# EAGLE design NFT-v1.0 (EAGLE 7.7.0)

## Sheet 1 of 5
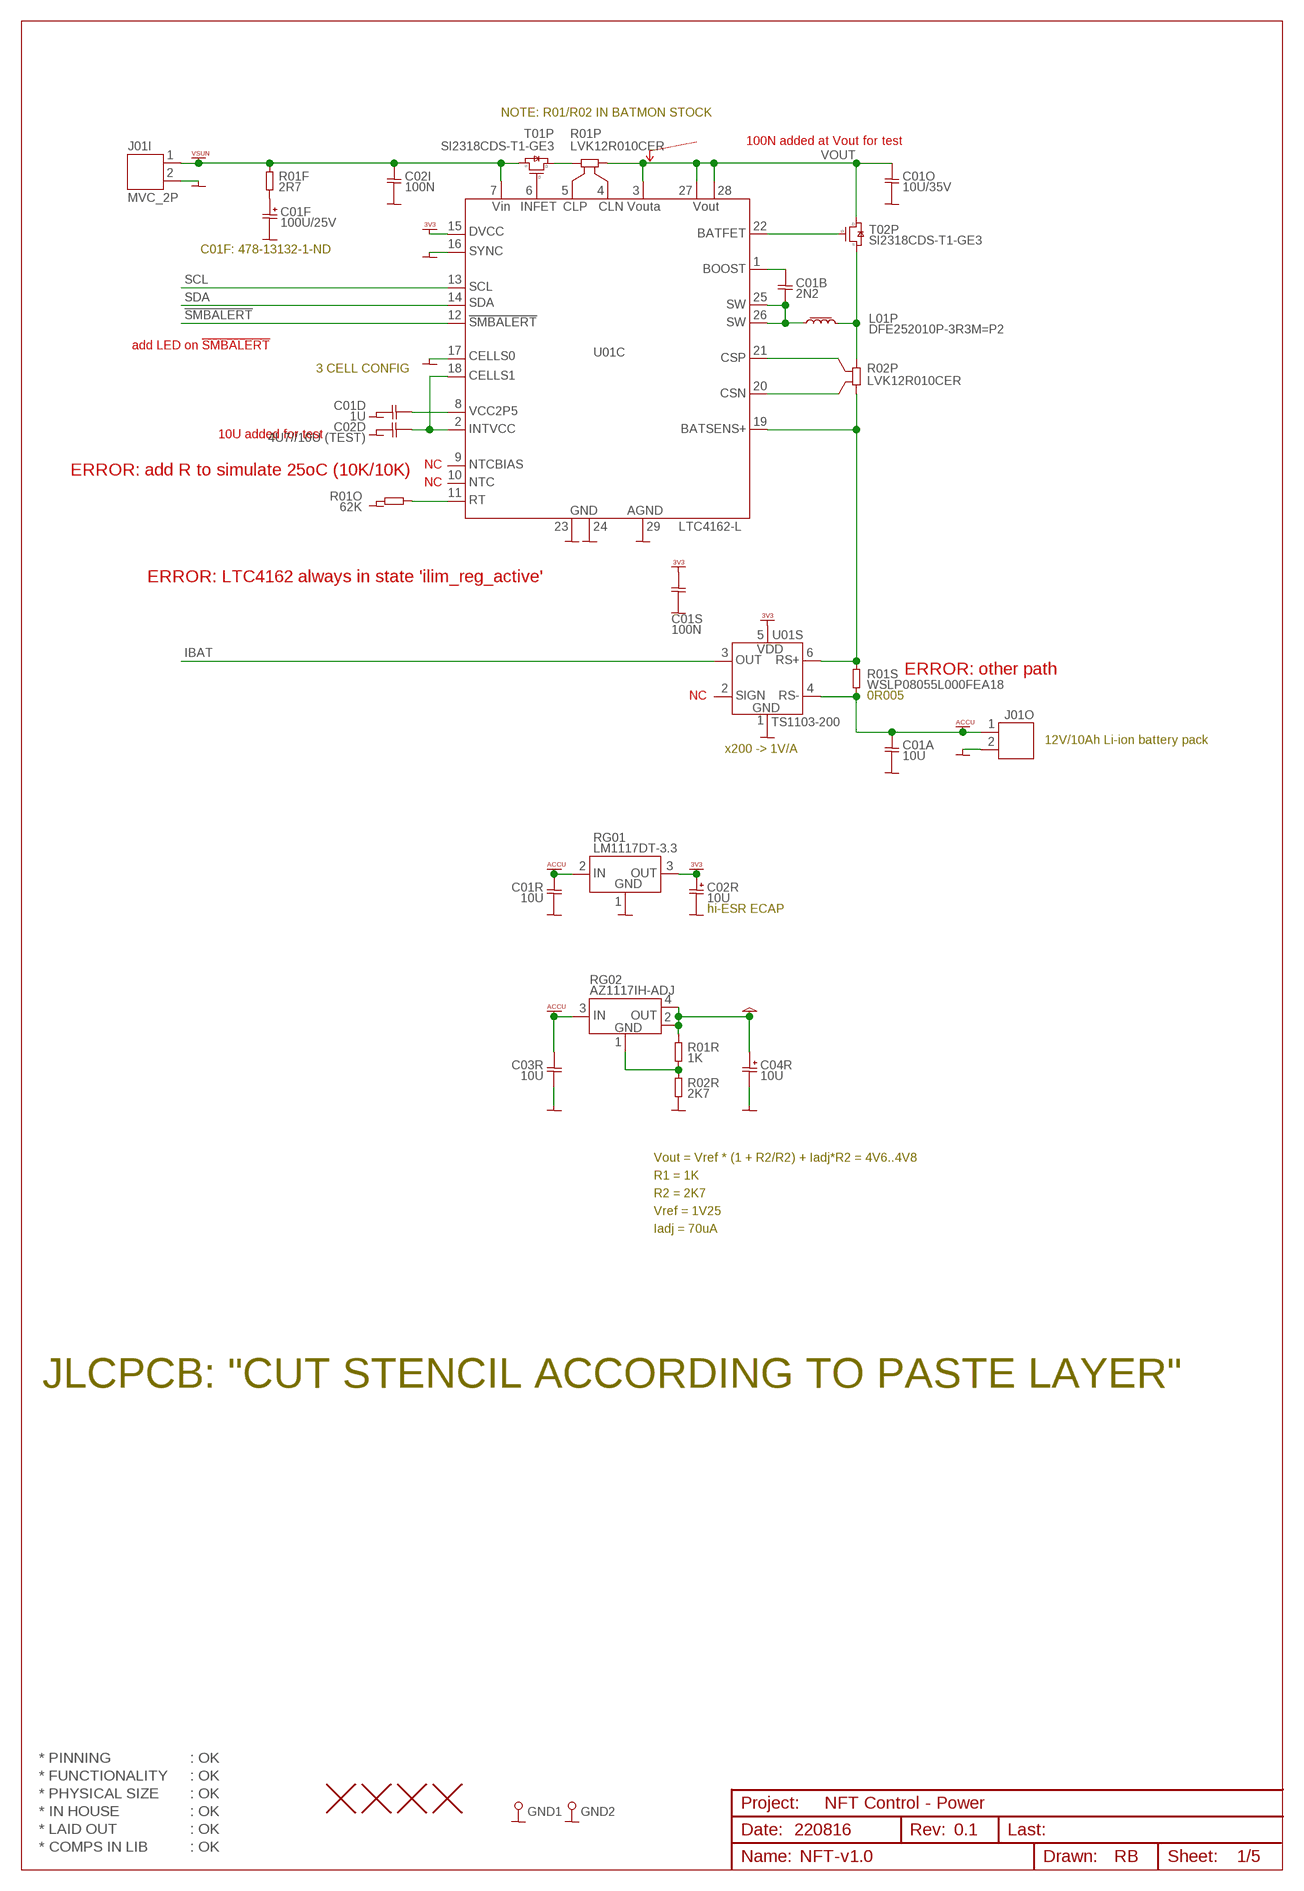
[diagram p0: schematic, sheet 1]

### Parts
C01A  10U  CAP0805  [CAP0805]
C01B  2N2  CAP0402  [CAP0402]
C01D  1U  CAP0402  [CAP0402]
C01F  100U/25V  ECAP_SMD  [ECAP_SMD]
C01O  10U/35V  CAP0805  [CAP0805]
C01R  10U  CAP0603  [CAP0603]
C01S  100N  CAP0402  [CAP0402]
C02D  4U7//10U (TEST)  CAP0402  [CAP0402]
C02I  100N  CAP0402  [CAP0402]
C02R  10U  ECAP_SMA  [ECAP_SMA]
C03R  10U  CAP0603  [CAP0603]
C04R  10U  ECAP_SMA  [ECAP_SMA]
GND1  PIN_TEST  [HOLE_PTH_0.8MM]
GND2  PIN_TEST  [HOLE_PTH_0.8MM]
H1  HOLE_NPTH_3.2MM  [HOLE_NPTH_3.2MM]
H2  HOLE_NPTH_3.2MM  [HOLE_NPTH_3.2MM]
H3  HOLE_NPTH_3.2MM  [HOLE_NPTH_3.2MM]
H4  HOLE_NPTH_3.2MM  [HOLE_NPTH_3.2MM]
J01I  MVC_2P  CON_PHOENIX_COMBICON_MCV_HEADER_2P  [CON_PHOENIX_COMBICON_MCV_HEADER_P]
J01O  CON_PHOENIX_COMBICON_MCV_HEADER_2P  [CON_PHOENIX_COMBICON_MCV_HEADER_P]
L01P  DFE252010P-3R3M=P2  L_1008  [L_1008]
R01F  2R7  RES0603  [RES0603]
R01O  62K  RES0402  [RES0402]
R01P  LVK12R010CER  RES1206_LVK12R010CER1206  [RES1206_LVK12R010CER]
R01R  1K  RES0402  [RES0402]
R01S  WSLP08055L000FEA18  RES0805  [RES0805]
R02P  LVK12R010CER  RES1206_LVK12R010CER1206  [RES1206_LVK12R010CER]
R02R  2K7  RES0402  [RES0402]
RG01  LM1117DT-3.3  [TO252]
RG02  AZ1117IH-ADJ  [SOT223]
T01P  SI2318CDS-T1-GE3  NFET_SOT23  [NFET_SOT23]
T02P  SI2318CDS-T1-GE3  NFET_SOT23  [NFET_SOT23]
U01C  LTC4162-L  [QFN28_4X5]
U01S  TS1103-200  [SOT23-6]

### Nets
!SMBALERT: U01C.12(12.!SMBALERT) ; also sheet 2
ACCU: C01A.1 C01R.1 C03R.1 J01O.1 R01S.2 RG01.2(2.IN) RG02.3(3.IN) U01S.4(4.RS-) ; supply symbol labelled VACCU ; also sheet 5
BATFET: T02P.G(G1) U01C.22(22.BATFET)
BOOST: C01B.1 U01C.1(1.BOOST)
CHARGER_OUT: R01S.1 R02P.1 U01C.19(19.BATSENS+) U01S.6(6.RS+)
CLN: R01P.4 U01C.4(4.CLN)
CLP: R01P.3 U01C.5(5.CLP)
CSN: R02P.3 U01C.20(20.CSN)
CSP: R02P.4 U01C.21(21.CSP)
FB1: R01R.2 R02R.1 RG02.1(1.GND)
GND: C01A.2 C01D.1 C01F.- C01O.2 C01R.2 C01S.2 C02D.1 C02I.2 C02R.- C03R.2 C04R.- GND1.1 GND2.1 J01I.2 J01O.2 R01O.1 R02R.2 RG01.1(1.GND) U01C.16(16.SYNC) U01C.17(17.CELLS0) U01C.23(23.GND) U01C.24(24.GND) U01C.29(29.AGND) U01C.V1(29.AGND) U01C.V2(29.AGND) U01C.V3(29.AGND) U01C.V4(29.AGND) U01S.1(1.GND) ; also sheet 2,3,4,5
IBAT: U01S.3(3.OUT) ; also sheet 2
INFET: T01P.G(G1) U01C.6(6.INFET)
INTVCC: C02D.2 U01C.2(2.INTVCC) U01C.18(18.CELLS1)
N$4: C01F.+ R01F.2
N$10: R01P.1 T01P.D(D3)
N$16: L01P.2 R02P.2 T02P.S(S2)
RT: R01O.2 U01C.11(11.RT)
SCL: U01C.13(13.SCL) ; also sheet 2
SDA: U01C.14(14.SDA) ; also sheet 2
SW: C01B.2 L01P.1 U01C.25(25.SW) U01C.26(26.SW)
VCC: C04R.+ R01R.1 RG02.2(2.OUT) RG02.4(4.OUT) ; also sheet 5
VCC2P5: C01D.2 U01C.8(8.VCC2P5)
VDD_3V3: C01S.1 C02R.+ RG01.3(3.OUT) U01C.15(15.DVCC) U01S.5(5.VDD) ; supply symbol labelled VCC_3V3 ; also sheet 2,3,4
VOUT: C01O.1 R01P.2 T02P.D(D3) U01C.3(3.VOUTA) U01C.27(27.VOUT) U01C.28(28.VOUT)
VSUN: C02I.1 J01I.1 R01F.1 T01P.S(S2) U01C.7(7.VIN)
Unconnected: U01C.9(9.NTCBIAS) U01C.10(10.NTC) U01S.2(2.SIGN)

### Notes on the sheet
- NOTE: R01/R02 IN BATMON STOCK
- 100N added at Vout for test
- C01F: 478-13132-1-ND
- add LED on !SMBALERT
- 3 CELL CONFIG
- 10U added for test
- NC
- ERROR: add R to simulate 25oC (10K/10K)
- NC
- ERROR: LTC4162 always in state 'ilim_reg_active'
- ERROR: other path
- NC | 0R005
- 12V/10Ah Li-ion battery pack
- x200 -> 1V/A
- hi-ESR ECAP
- Vout = Vref * (1 + R2/R2) + Iadj*R2 = 4V6..4V8
- R1 = 1K
- R2 = 2K7
- Vref = 1V25
- Iadj = 70uA
- JLCPCB: "CUT STENCIL ACCORDING TO PASTE LAYER"
- * PINNING | : OK
- * FUNCTIONALITY | : OK
- * PHYSICAL SIZE | : OK
- NFT Control - Power
- * IN HOUSE | : OK
- * LAID OUT | : OK | 220816 | 0.1
- * COMPS IN LIB | : OK

## Sheet 2 of 5
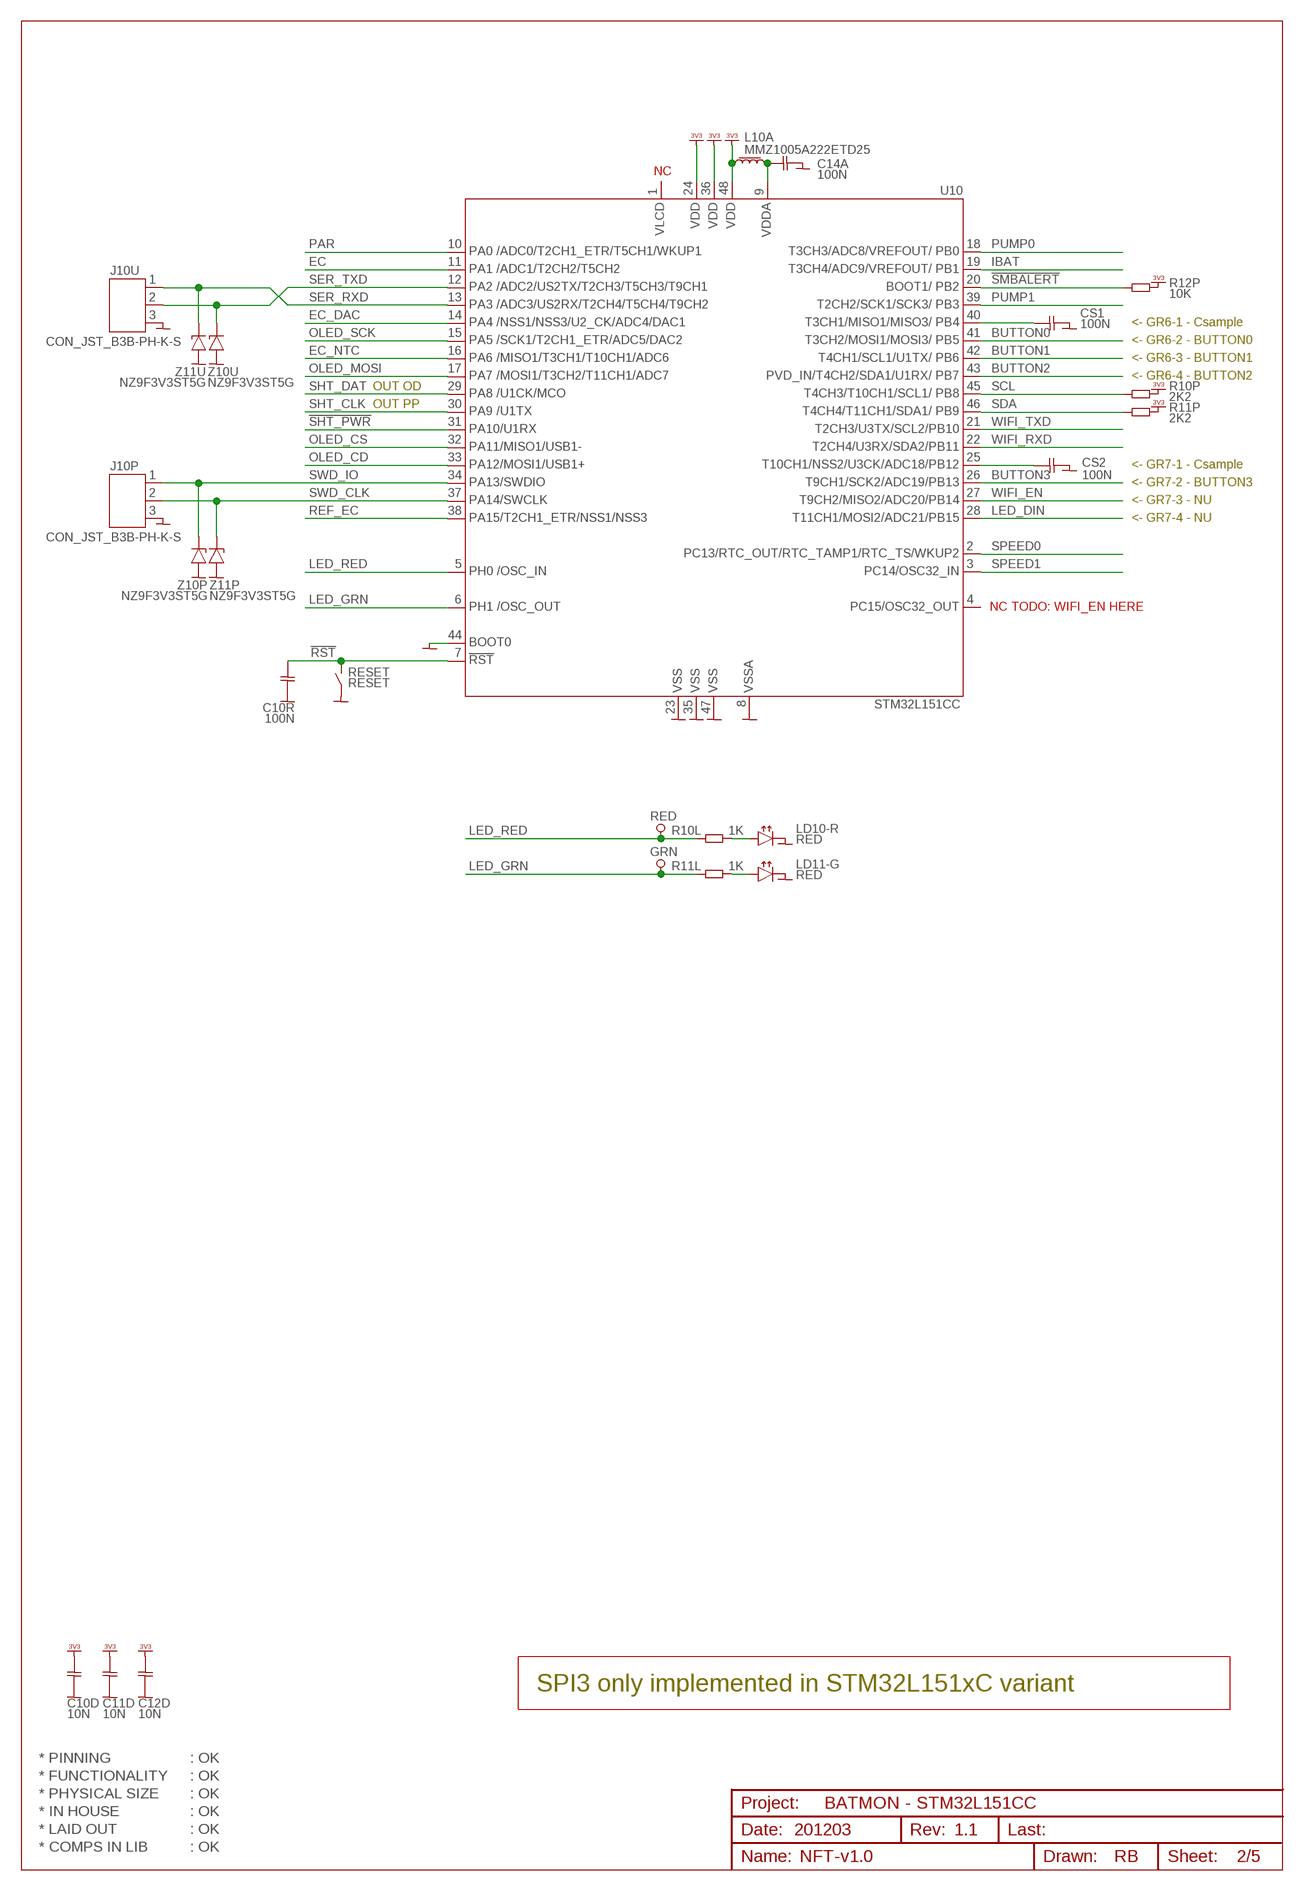
[diagram p1: schematic, sheet 2]

### Parts
C10D  10N  CAP0402  [CAP0402]
C10R  100N  CAP0402  [CAP0402]
C11D  10N  CAP0402  [CAP0402]
C12D  10N  CAP0402  [CAP0402]
C14A  100N  CAP0402  [CAP0402]
CS1  100N  CAP0402  [CAP0402]
CS2  100N  CAP0402  [CAP0402]
GRN  PIN_TEST_0.6MM  [HOLE_PTH_0.6MM]
J10P  CON_JST_B3B-PH-K-S  [CON_JST_B3B-PH-K-S]
J10U  CON_JST_B3B-PH-K-S  [CON_JST_B3B-PH-K-S]
L10A  MMZ1005A222ETD25  L_0402_LOSSY  [L_0402]
LD10-R  RED  LED_SMD_0402  [LED_SMD_0402]
LD11-G  RED  LED_SMD_0402  [LED_SMD_0402]
R10L  1K  RES0402  [RES0402]
R10P  2K2  RES0402  [RES0402]
R11L  1K  RES0402  [RES0402]
R11P  2K2  RES0402  [RES0402]
R12P  10K  RES0402  [RES0402]
RED  PIN_TEST_0.6MM  [HOLE_PTH_0.6MM]
RESET  RESET  SWITCH_PUSHBUTTON  [SWITCH_SMD_PBUTTON_2P]
U10  STM32L151CC  [LQFP48]
Z10P  NZ9F3V3ST5G  ZENER_SOD923  [ZENER_SOD923]
Z10U  NZ9F3V3ST5G  ZENER_SOD923  [ZENER_SOD923]
Z11P  NZ9F3V3ST5G  ZENER_SOD923  [ZENER_SOD923]
Z11U  NZ9F3V3ST5G  ZENER_SOD923  [ZENER_SOD923]

### Nets
!RST: C10R.1 RESET.1(1-2) U10.7(7.!RST)
!SHT_PWR: U10.31(31.PA10) ; also sheet 4
!SMBALERT: R12P.1 U10.20(20.PB2) ; also sheet 1
BUTTON0: U10.41(41.PB5) ; also sheet 3
BUTTON1: U10.42(42.PB6) ; also sheet 3
BUTTON2: U10.43(43.PB7) ; also sheet 3
BUTTON3: U10.26(26.PB13) ; also sheet 3
CSAMPLE: CS1.1 U10.40(40.PB4)
CSAMPLE1: CS2.1 U10.25(25.PB12)
EC: U10.11(11.PA1) ; also sheet 4
EC_DAC: U10.14(14.PA4) ; also sheet 4
EC_NTC: U10.16(16.PA6) ; also sheet 4
GND: C10D.2 C10R.2 C11D.2 C12D.2 C14A.2 CS1.2 CS2.2 J10P.3 J10U.3 LD10-R.C LD11-G.C RESET.2(3-4) U10.8(8.GND) U10.23(23.GND) U10.35(35.GND) U10.44(44.BOOT0) U10.47(47.GND) Z10P.2(A) Z10U.2(A) Z11P.2(A) Z11U.2(A) ; also sheet 1,3,4,5
IBAT: U10.19(19.PB1) ; also sheet 1
LED_DIN: U10.28(28.PB15) ; also sheet 5
LED_GRN: GRN.1 R11L.1 U10.6(6.OSC_OUT)
LED_RED: R10L.1 RED.1 U10.5(5.OSC_IN)
N$23: LD11-G.A R11L.2
N$39: LD10-R.A R10L.2
OLED_CD: U10.33(33.PA12) ; also sheet 3
OLED_CS: U10.32(32.PA11) ; also sheet 3
OLED_MOSI: U10.17(17.PA7) ; also sheet 3
OLED_SCK: U10.15(15.PA5) ; also sheet 3
PAR: U10.10(10.PA0) ; also sheet 4
PUMP0: U10.18(18.PB0) ; also sheet 5
PUMP1: U10.39(39.PB3) ; also sheet 5
REF_EC: U10.38(38.PA15) ; also sheet 4
SCL: R10P.1 U10.45(45.PB8) ; also sheet 1
SDA: R11P.1 U10.46(46.PB9) ; also sheet 1
SER_RXD: J10U.1 U10.13(13.PA3) Z11U.1(C)
SER_TXD: J10U.2 U10.12(12.PA2) Z10U.1(C)
SHT_CLK: U10.30(30.PA9) ; also sheet 4
SHT_DAT: U10.29(29.PA8) ; also sheet 4
SPEED0: U10.2(2.PC13) ; also sheet 5
SPEED1: U10.3(3.PC14) ; also sheet 5
SWD_CLK: J10P.2 U10.37(37.PA14) Z11P.1(C)
SWD_IO: J10P.1 U10.34(34.PA13) Z10P.1(C)
VDD_3V3: C10D.1 C11D.1 C12D.1 L10A.1 R10P.2 R11P.2 R12P.2 U10.24(24.VDD) U10.36(36.VDD) U10.48(48.VDD) ; supply symbol labelled VCC_3V3 ; also sheet 1,3,4
VDDA: C14A.1 L10A.2 U10.9(9.VDD)
WIFI_EN: U10.27(27.PB14) ; also sheet 3
WIFI_RXD: U10.22(22.PB11) ; also sheet 3
WIFI_TXD: U10.21(21.PB10) ; also sheet 3
Unconnected: U10.1(1.VDD) U10.4(4.PC15)

### Notes on the sheet
- NC
- <- GR6-1 - Csample
- <- GR6-2 - BUTTON0
- <- GR6-3 - BUTTON1
- <- GR6-4 - BUTTON2
- OUT OD
- OUT PP
- <- GR7-1 - Csample
- <- GR7-2 - BUTTON3
- <- GR7-3 - NU
- <- GR7-4 - NU
- NC TODO: WIFI_EN HERE
- SPI3 only implemented in STM32L151xC variant
- * PINNING | : OK
- * FUNCTIONALITY | : OK
- * PHYSICAL SIZE | : OK
- BATMON - STM32L151CC
- * IN HOUSE | : OK
- * LAID OUT | : OK | 201203 | 1.1
- * COMPS IN LIB | : OK

## Sheet 3 of 5
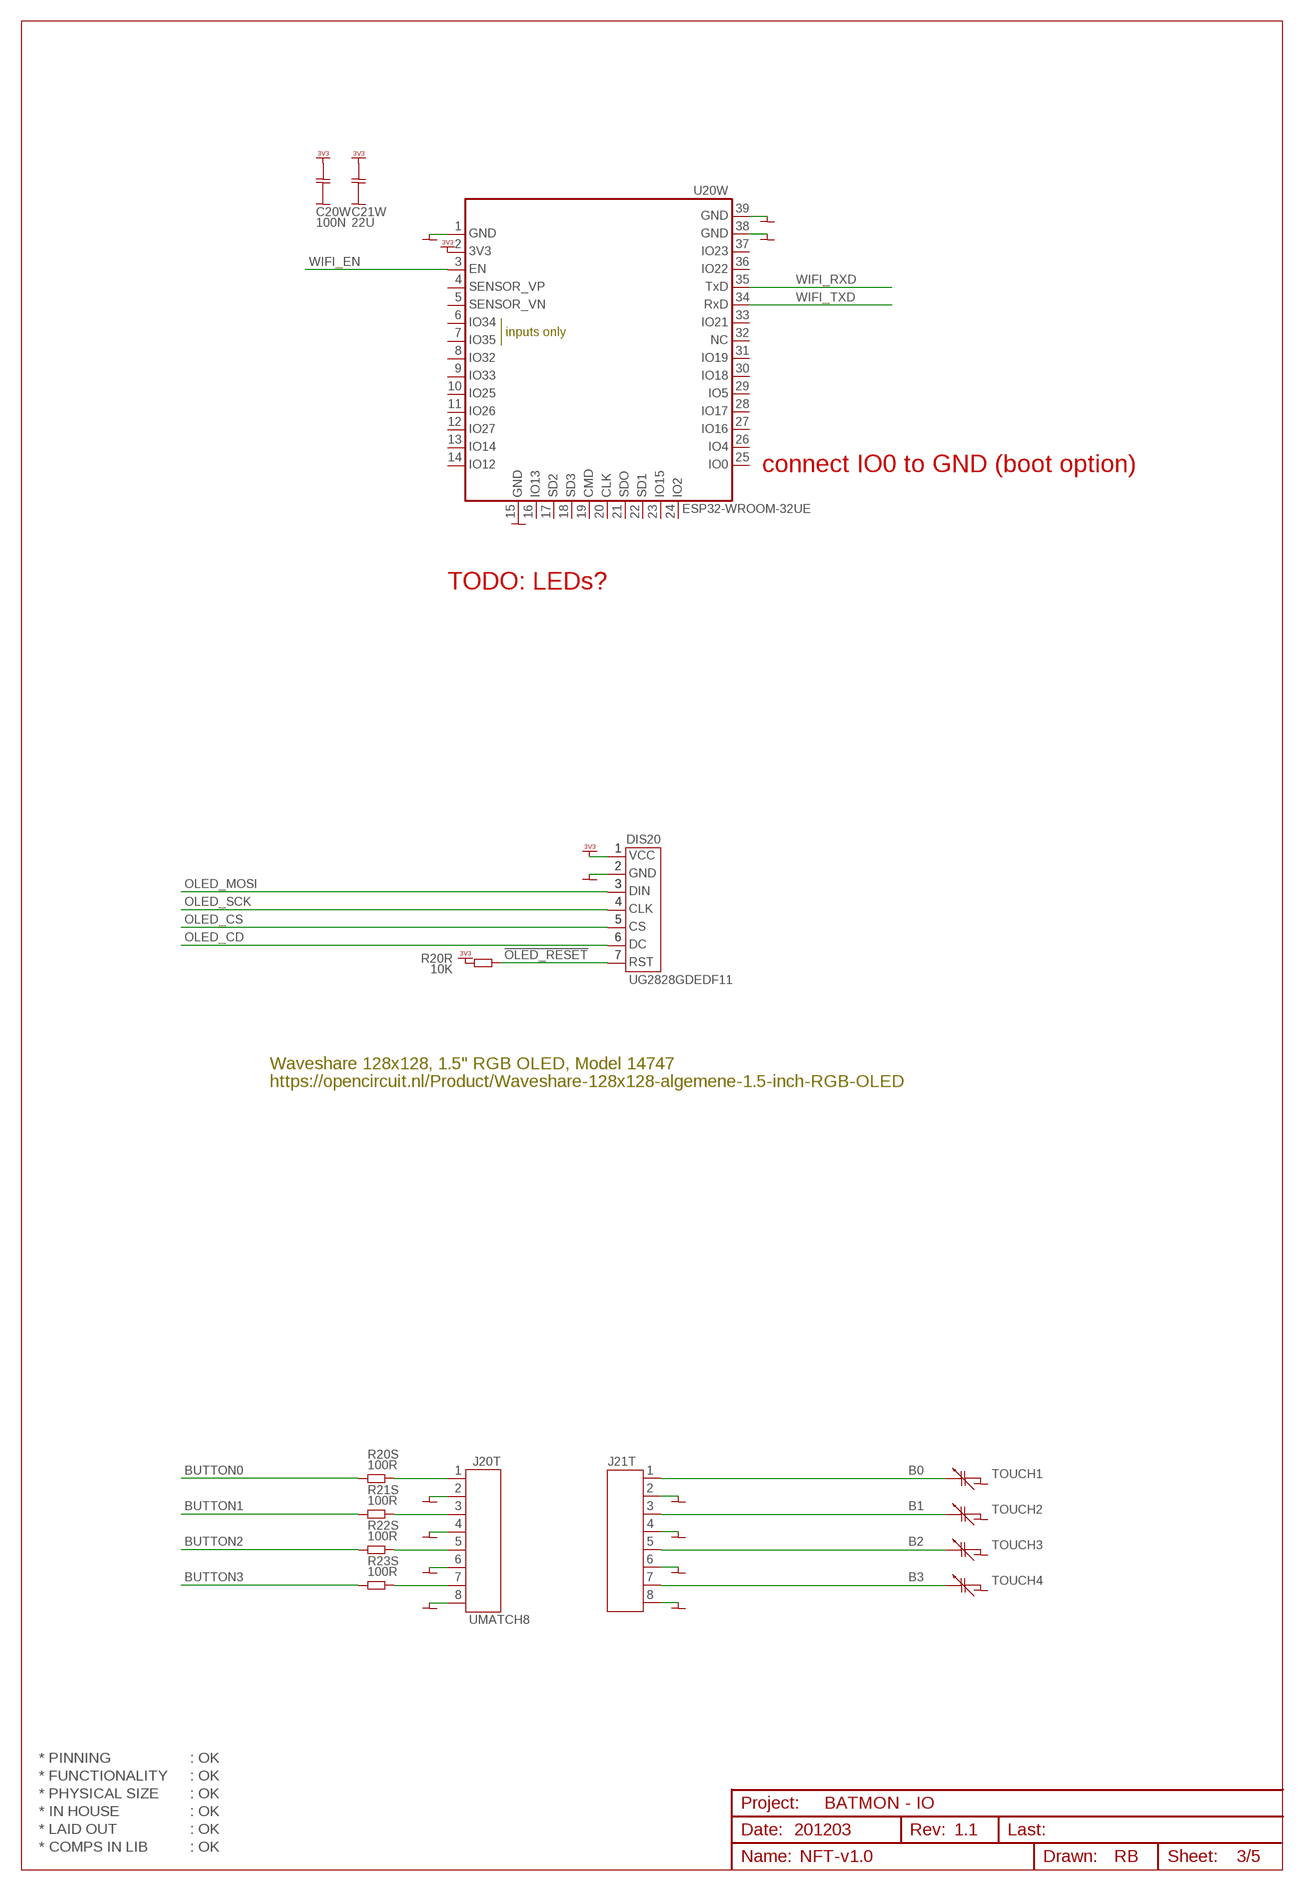
[diagram p2: schematic, sheet 3]

### Parts
C20W  100N  CAP0402  [CAP0402]
C21W  22U  CAP0805  [CAP0805]
DIS20  UG2828GDEDF11  WAVESHARE_1.5"OLED128X128  [WAVESHARE_1.5"OLED128X128]
J20T  UMATCH8  CON_MICROMATCH_8F-TOP  [CON_MICROMATCH_TOP_8F]
J21T  CON_MICROMATCH_8F_SMD-TOP  [CON_MICROMATCH_TOP_8F_SMD]
R20R  10K  RES0402  [RES0402]
R20S  100R  RES0402  [RES0402]
R21S  100R  RES0402  [RES0402]
R22S  100R  RES0402  [RES0402]
R23S  100R  RES0402  [RES0402]
TOUCH1  CAP_TOUCH_ROUND_10MM_SINGLE  [CAP_TOUCH_ROUND_10MM_SINGLE]
TOUCH2  CAP_TOUCH_ROUND_10MM_SINGLE  [CAP_TOUCH_ROUND_10MM_SINGLE]
TOUCH3  CAP_TOUCH_ROUND_10MM_SINGLE  [CAP_TOUCH_ROUND_10MM_SINGLE]
TOUCH4  CAP_TOUCH_ROUND_10MM_SINGLE  [CAP_TOUCH_ROUND_10MM_SINGLE]
U20W  ESP32-WROOM-32UE  [ESP32-WROOM-32UE]

### Nets
!OLED_RESET: DIS20.7(7.RST) R20R.2
B0: J20T.1 J21T.1 R20S.2 TOUCH1.1
B1: J20T.3 J21T.3 R21S.2 TOUCH2.1
B2: J20T.5 J21T.5 R22S.2 TOUCH3.1
B3: J20T.7 J21T.7 R23S.2 TOUCH4.1
BUTTON0: R20S.1 ; also sheet 2
BUTTON1: R21S.1 ; also sheet 2
BUTTON2: R22S.1 ; also sheet 2
BUTTON3: R23S.1 ; also sheet 2
GND: C20W.2 C21W.2 DIS20.2(2.GND) J20T.2 J20T.4 J20T.6 J20T.8 J21T.2 J21T.4 J21T.6 J21T.8 TOUCH1.2 TOUCH2.2 TOUCH3.2 TOUCH4.2 U20W.1(1.GND) U20W.15(15.GND) U20W.38(38.GND) U20W.GND(39.GND) ; also sheet 1,2,4,5
OLED_CD: DIS20.6(6.DC) ; also sheet 2
OLED_CS: DIS20.5(5.CS) ; also sheet 2
OLED_MOSI: DIS20.3(3.DIN) ; also sheet 2
OLED_SCK: DIS20.4(4.CLK) ; also sheet 2
VDD_3V3: C20W.1 C21W.1 DIS20.1(1.VCC) R20R.1 U20W.2(2.3V3) ; supply symbol labelled VCC_3V3 ; also sheet 1,2,4
WIFI_EN: U20W.3(3.EN) ; also sheet 2
WIFI_RXD: U20W.35(35.TXD0) ; also sheet 2
WIFI_TXD: U20W.34(34.RXD0) ; also sheet 2
Unconnected: U20W.4(4.SENSOR_VP) U20W.5(5.SENSOR_VN) U20W.6(6.IO34) U20W.7(7.IO35) U20W.8(8.IO32) U20W.9(9.IO33) U20W.10(10.IO25) U20W.11(11.IO26) U20W.12(12.IO27) U20W.13(13.IO14) U20W.14(14.IO12) U20W.16(16.IO13) U20W.17(17.SD2) U20W.18(18.SD3) U20W.19(19.CMD) U20W.20(20.CLK) U20W.21(21.SDO) U20W.22(22.SD1) U20W.23(23.IO15) U20W.24(24.IO2) U20W.25(25.IO0) U20W.26(26.IO4) U20W.27(27.IO16) U20W.28(28.IO17) U20W.29(29.IO5) U20W.30(30.IO18) U20W.31(31.IO19) U20W.32(32.NC) U20W.33(33.IO21) U20W.36(36.IO22) U20W.37(37.IO23)

### Notes on the sheet
- connect IO0 to GND (boot option)
- TODO: LEDs?
- Waveshare 128x128, 1.5" RGB OLED, Model 14747
- https://opencircuit.nl/Product/Waveshare-128x128-algemene-1.5-inch-RGB-OLED
- * PINNING | : OK
- * FUNCTIONALITY | : OK
- * PHYSICAL SIZE | : OK
- BATMON - IO
- * IN HOUSE | : OK
- * LAID OUT | : OK | 201203 | 1.1
- * COMPS IN LIB | : OK

## Sheet 4 of 5
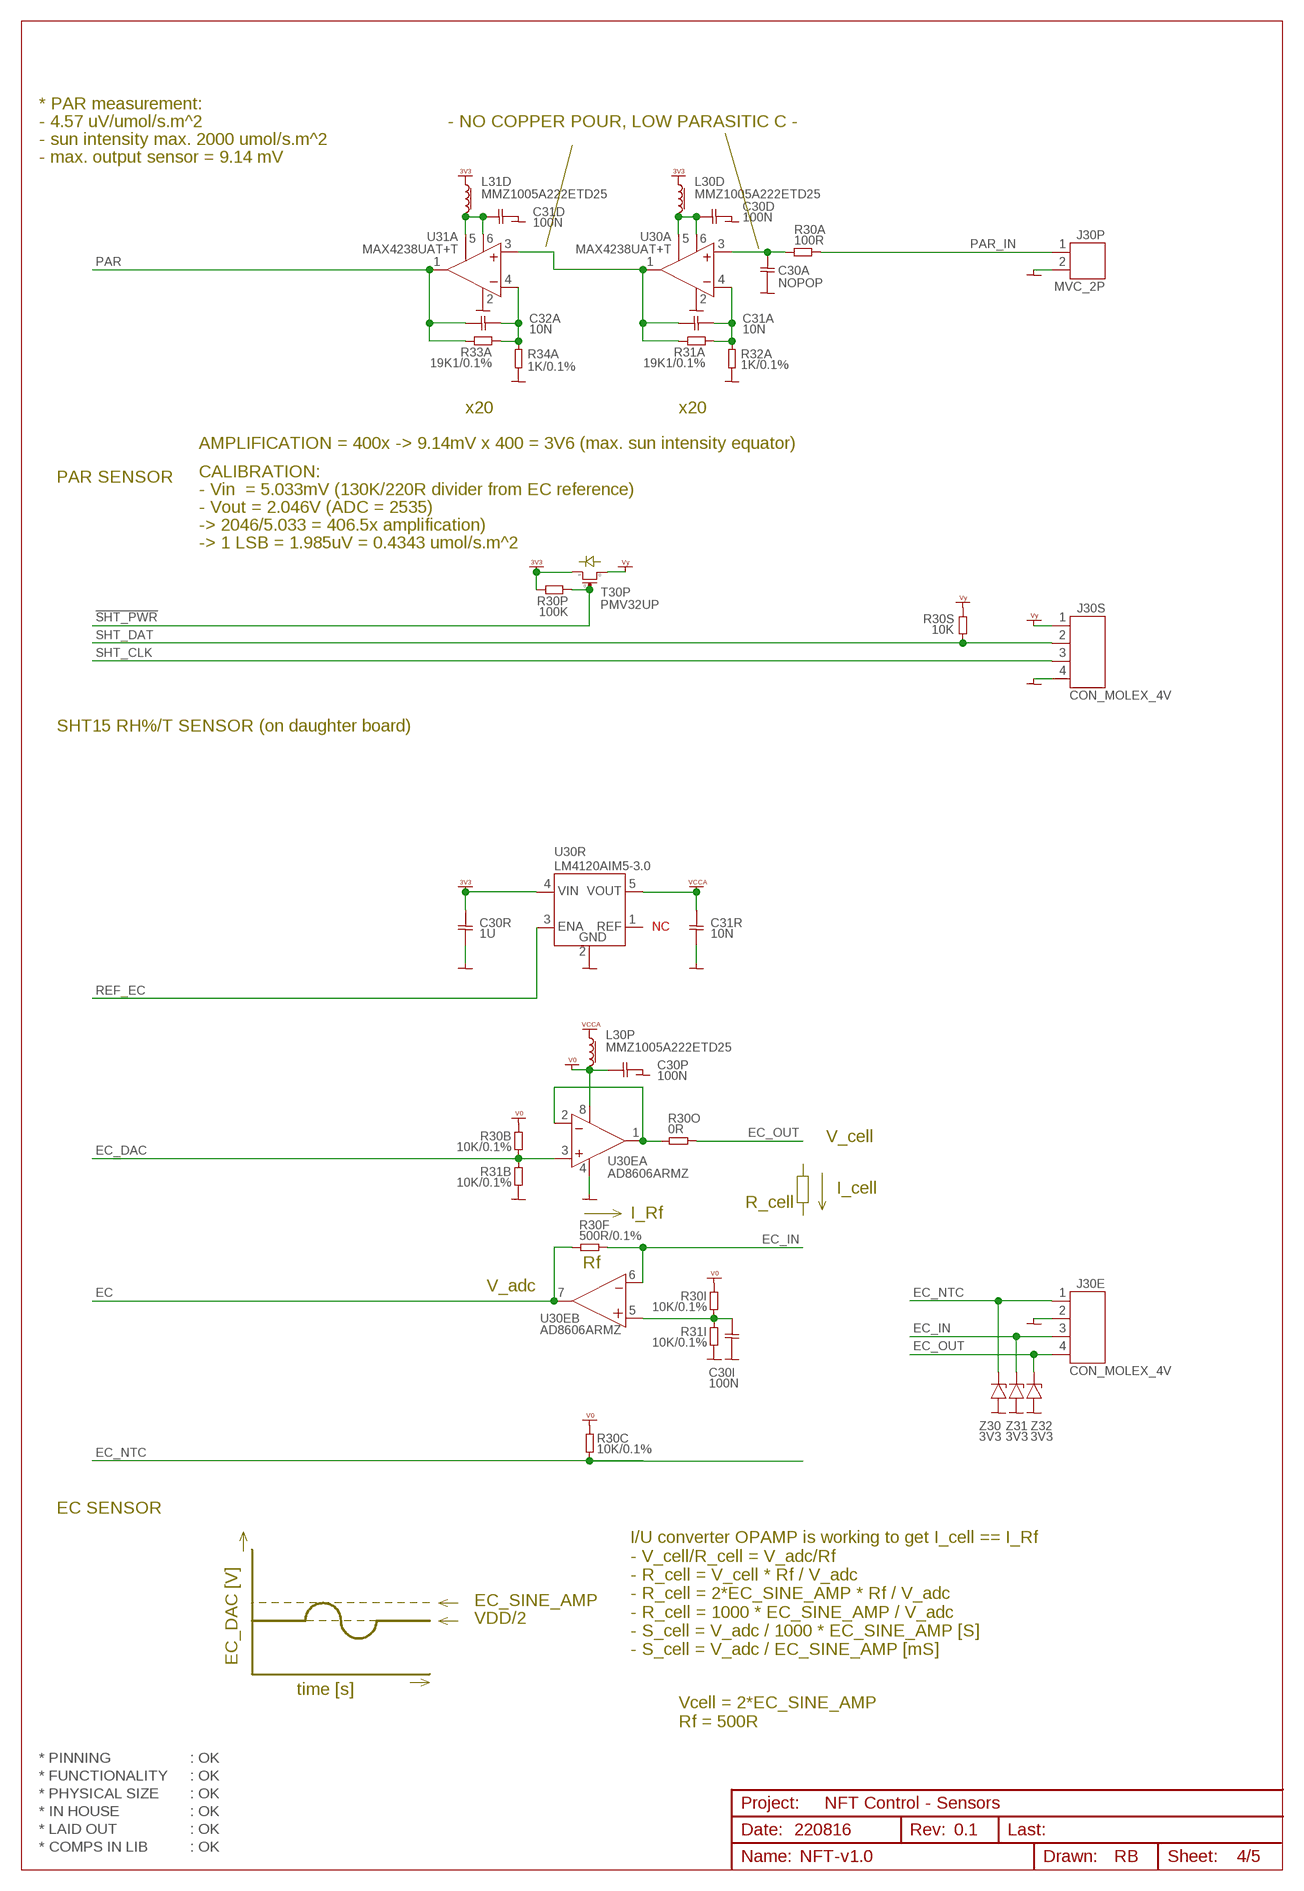
[diagram p3: schematic, sheet 4]

### Parts
C30A  NOPOP  CAP0402  [CAP0402]
C30D  100N  CAP0402  [CAP0402]
C30I  100N  CAP0402  [CAP0402]
C30P  100N  CAP0402  [CAP0402]
C30R  1U  CAP0402  [CAP0402]
C31A  10N  CAP0402  [CAP0402]
C31D  100N  CAP0402  [CAP0402]
C31R  10N  CAP0402  [CAP0402]
C32A  10N  CAP0402  [CAP0402]
J30E  CON_MOLEX_4V  [CON_MOLEX_4V]
J30P  MVC_2P  CON_PHOENIX_COMBICON_MCV_HEADER_2P  [CON_PHOENIX_COMBICON_MCV_HEADER_P]
J30S  CON_MOLEX_4V  [CON_MOLEX_4V]
L30D  MMZ1005A222ETD25  L_0402_LOSSY  [L_0402]
L30P  MMZ1005A222ETD25  L_0402_LOSSY  [L_0402]
L31D  MMZ1005A222ETD25  L_0402_LOSSY  [L_0402]
R30A  100R  RES0402  [RES0402]
R30B  10K/0.1%  RES0402  [RES0402]
R30C  10K/0.1%  RES0402  [RES0402]
R30F  500R/0.1%  RES0402  [RES0402]
R30I  10K/0.1%  RES0402  [RES0402]
R30O  0R  RES0402  [RES0402]
R30P  100K  RES0402  [RES0402]
R30S  10K  RES0402  [RES0402]
R31A  19K1/0.1%  RES0402  [RES0402]
R31B  10K/0.1%  RES0402  [RES0402]
R31I  10K/0.1%  RES0402  [RES0402]
R32A  1K/0.1%  RES0402  [RES0402]
R33A  19K1/0.1%  RES0402  [RES0402]
R34A  1K/0.1%  RES0402  [RES0402]
T30P  PMV32UP  PFET_SOT23  [PFET_SOT23]
U30A  MAX4238UAT+T  [SOT23-6]
U30E  AD8606ARMZ  [MSOP8]
U30R  LM4120AIM5-3.0  [SOT23-5]
U31A  MAX4238UAT+T  [SOT23-6]
Z30  3V3  ZENER_SOD80  [ZENER_SOD80]
Z31  3V3  ZENER_SOD80  [ZENER_SOD80]
Z32  3V3  ZENER_SOD80  [ZENER_SOD80]

### Nets
!SHT_PWR: R30P.2 T30P.1(G) ; also sheet 2
EC: R30F.2 U30E.7(B:7.OUT) ; also sheet 2
EC30_BUF: R30O.2 U30E.1(A:1.OUT) U30E.2(A:2.IN-)
EC_DAC: R30B.2 R31B.1 U30E.3(A:3.IN+) ; also sheet 2
EC_IN: J30E.3 R30F.1 U30E.6(B:6.IN-) Z31.2(C)
EC_NTC: J30E.1 R30C.2 Z30.2(C) ; also sheet 2
EC_OUT: J30E.4 R30O.1 Z32.2(C)
GND: C30A.1 C30D.2 C30I.1 C30P.2 C30R.2 C31D.2 C31R.2 J30E.2 J30P.2 J30S.4 R31B.2 R31I.2 R32A.2 R34A.2 U30A.2(2.V-) U30E.4(A:4.V-) U30R.2(2.GND) U31A.2(2.V-) Z30.1(A) Z31.1(A) Z32.1(A) ; also sheet 1,2,3,5
IMUXF: C30A.2 R30A.2 U30A.3(3.IN+)
N$6: C31D.1 L31D.2 U31A.5(5.!SHDN) U31A.6(6.V+)
N$8: C30I.2 R30I.2 R31I.1 U30E.5(B:5.IN+)
N$15: C30D.1 L30D.2 U30A.5(5.!SHDN) U30A.6(6.V+)
N$20: C32A.2 R33A.1 R34A.1 U31A.4(4.IN-)
N$21: C31A.1 R31A.2 U30A.1(1.OUT) U31A.3(3.IN+)
N$22: C31A.2 R31A.1 R32A.1 U30A.4(4.IN-)
PAR: C32A.1 R33A.2 U31A.1(1.OUT) ; also sheet 2
PAR_IN: J30P.1 R30A.1
REF_EC: U30R.3(3.ENA) ; also sheet 2
SHT_CLK: J30S.3 ; also sheet 2
SHT_DAT: J30S.2 R30S.2 ; also sheet 2
V0: C30P.1 L30P.2 R30B.1 R30C.1 R30I.1 U30E.8(A:8.V+)
VCCA: C31R.1 L30P.1 U30R.5(5.VOUT)
VDD_3V3: C30R.1 L30D.1 L31D.1 R30P.1 T30P.2(S) U30R.4(4.VIN) ; supply symbol labelled VCC_3V3 ; also sheet 1,2,3
VY: J30S.1 R30S.1 T30P.3(D)
Unconnected: U30R.1(1.REF)

### Notes on the sheet
- * PAR measurement:
- - 4.57 uV/umol/s.m^2 | - NO COPPER POUR, LOW PARASITIC C -
- - sun intensity max. 2000 umol/s.m^2
- - max. output sensor = 9.14 mV
- x20 | x20
- AMPLIFICATION = 400x -> 9.14mV x 400 = 3V6 (max. sun intensity equator)
- CALIBRATION:
- PAR SENSOR
- - Vin  = 5.033mV (130K/220R divider from EC reference)
- - Vout = 2.046V (ADC = 2535)
- -> 2046/5.033 = 406.5x amplification)
- -> 1 LSB = 1.985uV = 0.4343 umol/s.m^2
- SHT15 RH%/T SENSOR (on daughter board)
- NC
- V_cell
- I_cell
- R_cell
- I_Rf
- Rf
- V_adc
- EC SENSOR
- EC_SINE_AMP
- VDD/2
- EC_DAC [V]
- I/U converter OPAMP is working to get I_cell == I_Rf
   - V_cell/R_cell = V_adc/Rf 
   - R_cell = V_cell * Rf / V_adc          
   - R_cell = 2*EC_SINE_AMP * Rf / V_adc    
   - R_cell = 1000 * EC_SINE_AMP / V_adc
   - S_cell = V_adc / 1000 * EC_SINE_AMP [S]
   - S_cell = V_adc / EC_SINE_AMP [mS]
- time [s]
- Vcell = 2*EC_SINE_AMP
  Rf = 500R
- * PINNING | : OK
- * FUNCTIONALITY | : OK
- * PHYSICAL SIZE | : OK
- NFT Control - Sensors
- * IN HOUSE | : OK
- * LAID OUT | : OK | 220816 | 0.1
- * COMPS IN LIB | : OK

## Sheet 5 of 5
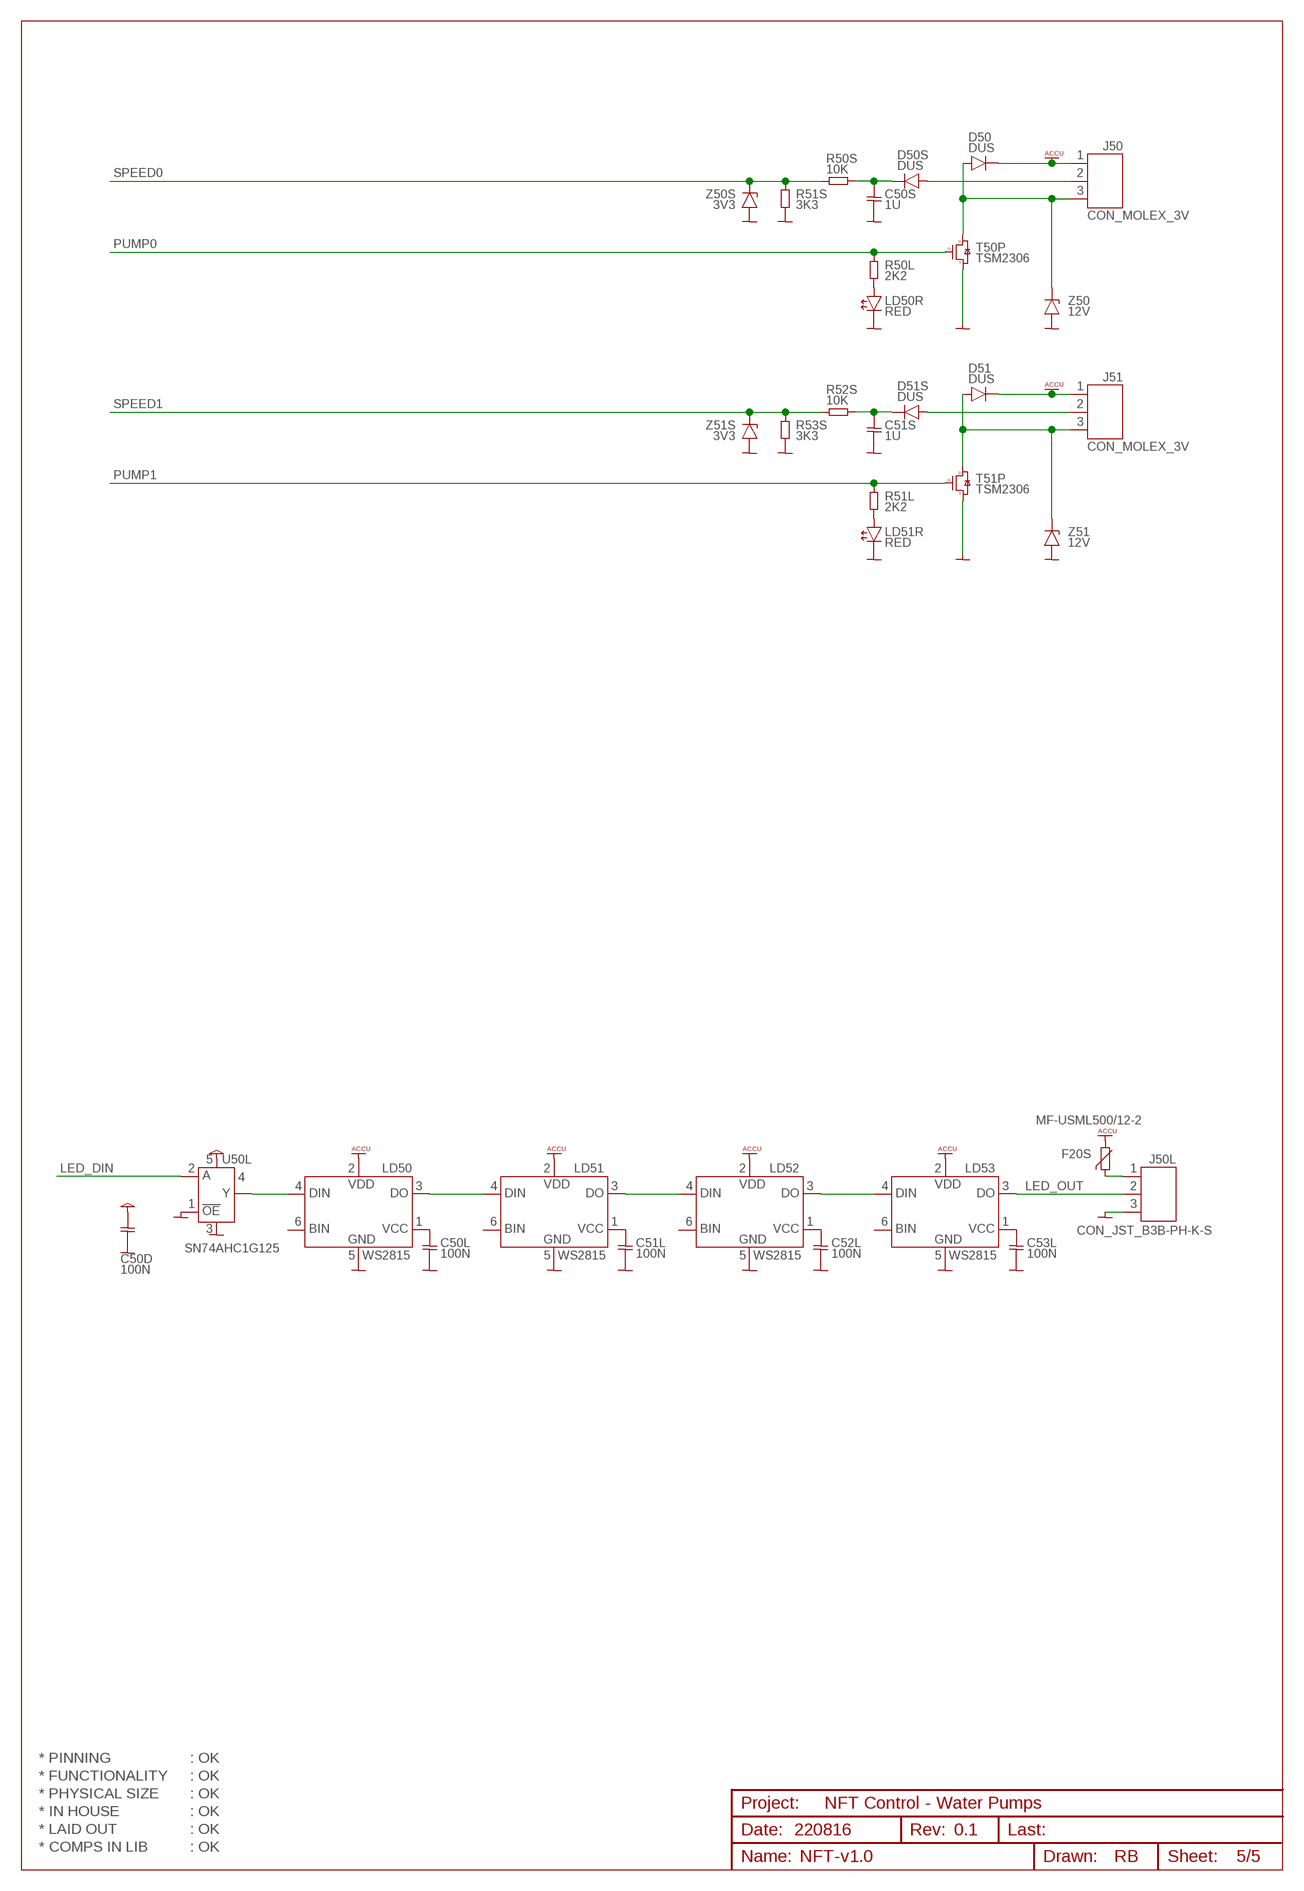
[diagram p4: schematic, sheet 5]

### Parts
C50D  100N  CAP0402  [CAP0402]
C50L  100N  CAP0402  [CAP0402]
C50S  1U  CAP0402  [CAP0402]
C51L  100N  CAP0402  [CAP0402]
C51S  1U  CAP0402  [CAP0402]
C52L  100N  CAP0402  [CAP0402]
C53L  100N  CAP0402  [CAP0402]
D50  DUS  DIODE_1N4148WS  [DIODE_SOD323]
D50S  DUS  DIODE_1N4148WS  [DIODE_SOD323]
D51  DUS  DIODE_1N4148WS  [DIODE_SOD323]
D51S  DUS  DIODE_1N4148WS  [DIODE_SOD323]
F20S  MF-USML500/12-2  PTC1210  [RES1210]
J50  CON_MOLEX_3V  [CON_MOLEX_3V]
J50L  CON_JST_B3B-PH-K-S  [CON_JST_B3B-PH-K-S]
J51  CON_MOLEX_3V  [CON_MOLEX_3V]
LD50  WS2815  [WS2815]
LD50R  RED  LED_SMD_0402  [LED_SMD_0402]
LD51  WS2815  [WS2815]
LD51R  RED  LED_SMD_0402  [LED_SMD_0402]
LD52  WS2815  [WS2815]
LD53  WS2815  [WS2815]
R50L  2K2  RES0402  [RES0402]
R50S  10K  RES0402  [RES0402]
R51L  2K2  RES0402  [RES0402]
R51S  3K3  RES0402  [RES0402]
R52S  10K  RES0402  [RES0402]
R53S  3K3  RES0402  [RES0402]
T50P  TSM2306  NFET_SOT23  [NFET_SOT23]
T51P  TSM2306  NFET_SOT23  [NFET_SOT23]
U50L  SN74AHC1G125  SN74AHC1G125DRLR  [SOT553-5]
Z50  12V  ZENER_SOD80  [ZENER_SOD80]
Z50S  3V3  ZENER_SOD80  [ZENER_SOD80]
Z51  12V  ZENER_SOD80  [ZENER_SOD80]
Z51S  3V3  ZENER_SOD80  [ZENER_SOD80]

### Nets
ACCU: D50.1-(-) D51.1-(-) F20S.2 J50.1 J51.1 LD50.2(2.VDD) LD51.2(2.VDD) LD52.2(2.VDD) LD53.2(2.VDD) ; supply symbol labelled VACCU ; also sheet 1
DI: LD50.4(4.DIN) U50L.4(4.Y)
GND: C50D.2 C50L.2 C50S.2 C51L.2 C51S.2 C52L.2 C53L.2 J50L.3 LD50.5(5.GND) LD50R.C LD51.5(5.GND) LD51R.C LD52.5(5.GND) LD53.5(5.GND) R51S.2 R53S.2 T50P.S(S2) T51P.S(S2) U50L.1(1.OE) U50L.3(3.GND) Z50.1(A) Z50S.1(A) Z51.1(A) Z51S.1(A) ; also sheet 1,2,3,4
LED_DIN: U50L.2(2.A) ; also sheet 2
LED_OUT: J50L.2 LD53.3(3.DO)
N$7: C50L.1 LD50.1(1.VCC)
N$9: C51L.1 LD51.1(1.VCC)
N$11: C52L.1 LD52.1(1.VCC)
N$12: C53L.1 LD53.1(1.VCC)
N$13: LD51R.A R51L.2
N$14: C50S.1 D50S.1-(-) R50S.2
N$17: C51S.1 D51S.1-(-) R52S.2
N$31: F20S.1 J50L.1
N$70: LD50R.A R50L.2
P0: D50.2(+) J50.3 T50P.D(D3) Z50.2(C)
P1: D51.2(+) J51.3 T51P.D(D3) Z51.2(C)
PUMP0: R50L.1 T50P.G(G1) ; also sheet 2
PUMP1: R51L.1 T51P.G(G1) ; also sheet 2
S0: D50S.2(+) J50.2
S1: D51S.2(+) J51.2
SPEED0: R50S.1 R51S.1 Z50S.2(C) ; also sheet 2
SPEED1: R52S.1 R53S.1 Z51S.2(C) ; also sheet 2
VCC: C50D.1 U50L.5(5.VDD) ; also sheet 1
X0: LD50.3(3.DO) LD51.4(4.DIN)
X1: LD51.3(3.DO) LD52.4(4.DIN)
X2: LD52.3(3.DO) LD53.4(4.DIN)
Unconnected: LD50.6(6.BIN) LD51.6(6.BIN) LD52.6(6.BIN) LD53.6(6.BIN)

### Notes on the sheet
- * PINNING | : OK
- * FUNCTIONALITY | : OK
- * PHYSICAL SIZE | : OK
- NFT Control - Water Pumps
- * IN HOUSE | : OK
- * LAID OUT | : OK | 220816 | 0.1
- * COMPS IN LIB | : OK

## Library data of the parts
C01A C01O C21W = 00-own_parts:CAP0805: Capacitor, ceramic, 0805
C01B C01D C01S C02D C02I C10D C10R C11D C12D C14A C20W C30A C30D C30I C30P C30R C31A C31D C31R C32A C50D C50L C50S C51L C51S C52L C53L CS1 CS2 = 00-own_parts:CAP0402: Capacitor, ceramic, 0402
C01F = 00-own_parts:ECAP_SMD: Capacitor, tantalum, case D (2917)
C01R C03R = 00-own_parts:CAP0603: Capacitor, ceramic, 0603
C02R C04R = 00-own_parts:ECAP_SMA: Capacitor, tantalum, case A (1206)
D50 D50S D51 D51S = 00-own_parts:DIODE_1N4148WS: Diode, 1N4148WS, high speed, 100V/350mA, SOD323
DIS20 = 00-own_parts:WAVESHARE_1.5"OLED128X128: Display, OLED, RGB128x128, Vsupply: 3V3..5V, SPI
F20S = 00-own_parts:PTC: PTC multifuse. MF-RX160/72, I holding: 1.6A, I trip: 3.2A. F#:9350144
GND1 GND2 = 00-own_parts:PIN_TEST: Pin, test pad, hole 0.8mm, pad 1.6mm
GRN RED = 00-own_parts:PIN_TEST_0.6MM: Pin, test pad, hole 0.6mm, pad 1.0mm
H1-H4 = 00-own_parts:HOLE_NPTH_3.2MM: Hole, NPTH, 3.2mm
J01I J01O J30P = 00-own_parts:CON_PHOENIX_COMBICON_MCV_HEADER_2P: Connector, Phoenix, COMBICON MCV, 3.5mm, header, male pins, 2p, 1843619, F#370-4816
J10P J10U J50L = 00-own_parts:CON_JST_B3B-PH-K-S: Connector, JST, 2.0mm pitch, 3p, top entry
J20T = 00-own_parts:CON_MICROMATCH_8F: Connector, PCB, micromatch, female, 8p, F# 148-593
J21T = 00-own_parts:CON_MICROMATCH_8F_SMD: Connector, PCB, micromatch, female, 8p, F# 148-593
J30E J30S = 00-own_parts:CON_MOLEX_4V: Connector, Molex, header, straight, 0.1", 4p, F#973-1164
J50 J51 = 00-own_parts:CON_MOLEX_3V: Connector, Molex, header, straight, 0.1", 3p, F#973-1156
L01P = 00-own_parts:L_1008: Inductor, 1008 (2520 metric), chip ferrite bead/wirewound
L10A L30D L30P L31D = 00-own_parts:L_0402_LOSSY: Inductor, chip ferrite bead, lossy, 0402
LD10-R LD11-G LD50R LD51R = 00-own_parts:LED_SMD_0402: LED, SMD, 0402 (PICOLED)
LD50-LD53 = 00-own_parts:WS2815: LED, serial, 12V, 5050
R01F R01O R01R R01S R02R R10L R10P R11L R11P R12P R20R R20S R21S R22S R23S R30A R30B R30C R30F R30I R30O R30P R30S R31A R31B R31I R32A R33A R34A R50L R50S R51L R51S R52S R53S = 00-own_parts:RES
R01P R02P = 00-own_parts:RES1206_LVK12R010CER: Resistor, four terminal current sense, 0.5W, Imax = 20A, RES1206, DK# 273-LVK12R010CERCT-ND
RESET = 00-own_parts:SWITCH_PUSHBUTTON: Switch, push button, SPNO, MCTAEF, F# 160-5485
RG01 = 00-own_parts:LM1117DT-3.3: Regulator, 800mA, Vdrop: 1V, Vin_max: 20V, Vout: 3V3, TO252, F# 948-6275
RG02 = 00-own_parts:AZ1117IH-ADJ: Regulator,adjust/800mA, Vdrop: 1V2, Vin_max: 18V, Vout: 1V5 ≤ Vin-Vout ≤ 10V, SOT223, F#348-3089
T01P T02P T50P T51P = 00-own_parts:NFET_SOT23: n-FET, generic SOT23
T30P = 00-own_parts:PFET_SOT23: p-FET, generic, SOT23
TOUCH1-TOUCH4 = 00-own_parts:CAP_TOUCH_ROUND_10MM_SINGLE: Capacitor, touch sensor, single layer, round 10MM
U01C = 00-own_parts:LTC4162-L: DC/DC converter, battery charger, solar, MMPT, 35V/3A2, QNF28 (4x5mm)
U01S = 00-own_parts:TS1103-200: Current sense amplifier, bi-directional, 200x gain, SOT23-6, F#243-7987
U10 = 00-own_parts:STM32L151CC: MCU, ultra-low power, ARM Cortex M3, 32-bit, 32 MHz, 256 kB Flash, 32 kB SRAM, 8 kB EEPROM, USB, ADC, DAC, LQFP48
U20W = 00-own_parts:ESP32-WROOM-32UE: Wireless module, WiFi & Bluetooth, external u.fl antenna
U30A U31A = 00-own_parts:MAX4238UAT+T: OPAMP, auto-zero, w. 100nA shutdown, rail-to-rail, Voffset = 0.1uV, Voffset drift: 10nV/°C, Ib = 100 pA, Vdd = 2V7..5V5, Idd = 0.6mA, SOT23-5
U30E = 00-own_parts:AD8606ARMZ: OPAMP, dual, single supply, precision low noise rail to rail op-amp, MSOP8, DK# AD8606ARMZ-R7CT-ND
U30R = 00-own_parts:LM4120AIM5-3.0: Reference, series, with enable, 3V00, SOT23-5
U50L = 00-own_parts:SN74AHC1G125DRLR: Buffer, non-inverting, inverted enable, Hi-Z output, single gate, SOT553-5, F#300-6124
Z10P Z10U Z11P Z11U = 00-own_parts:ZENER_SOD923: Zener, generic SOD923
Z30-Z32 Z50 Z50S Z51 Z51S = 00-own_parts:ZENER_SOD80: Zener, generic SOD80

## Board
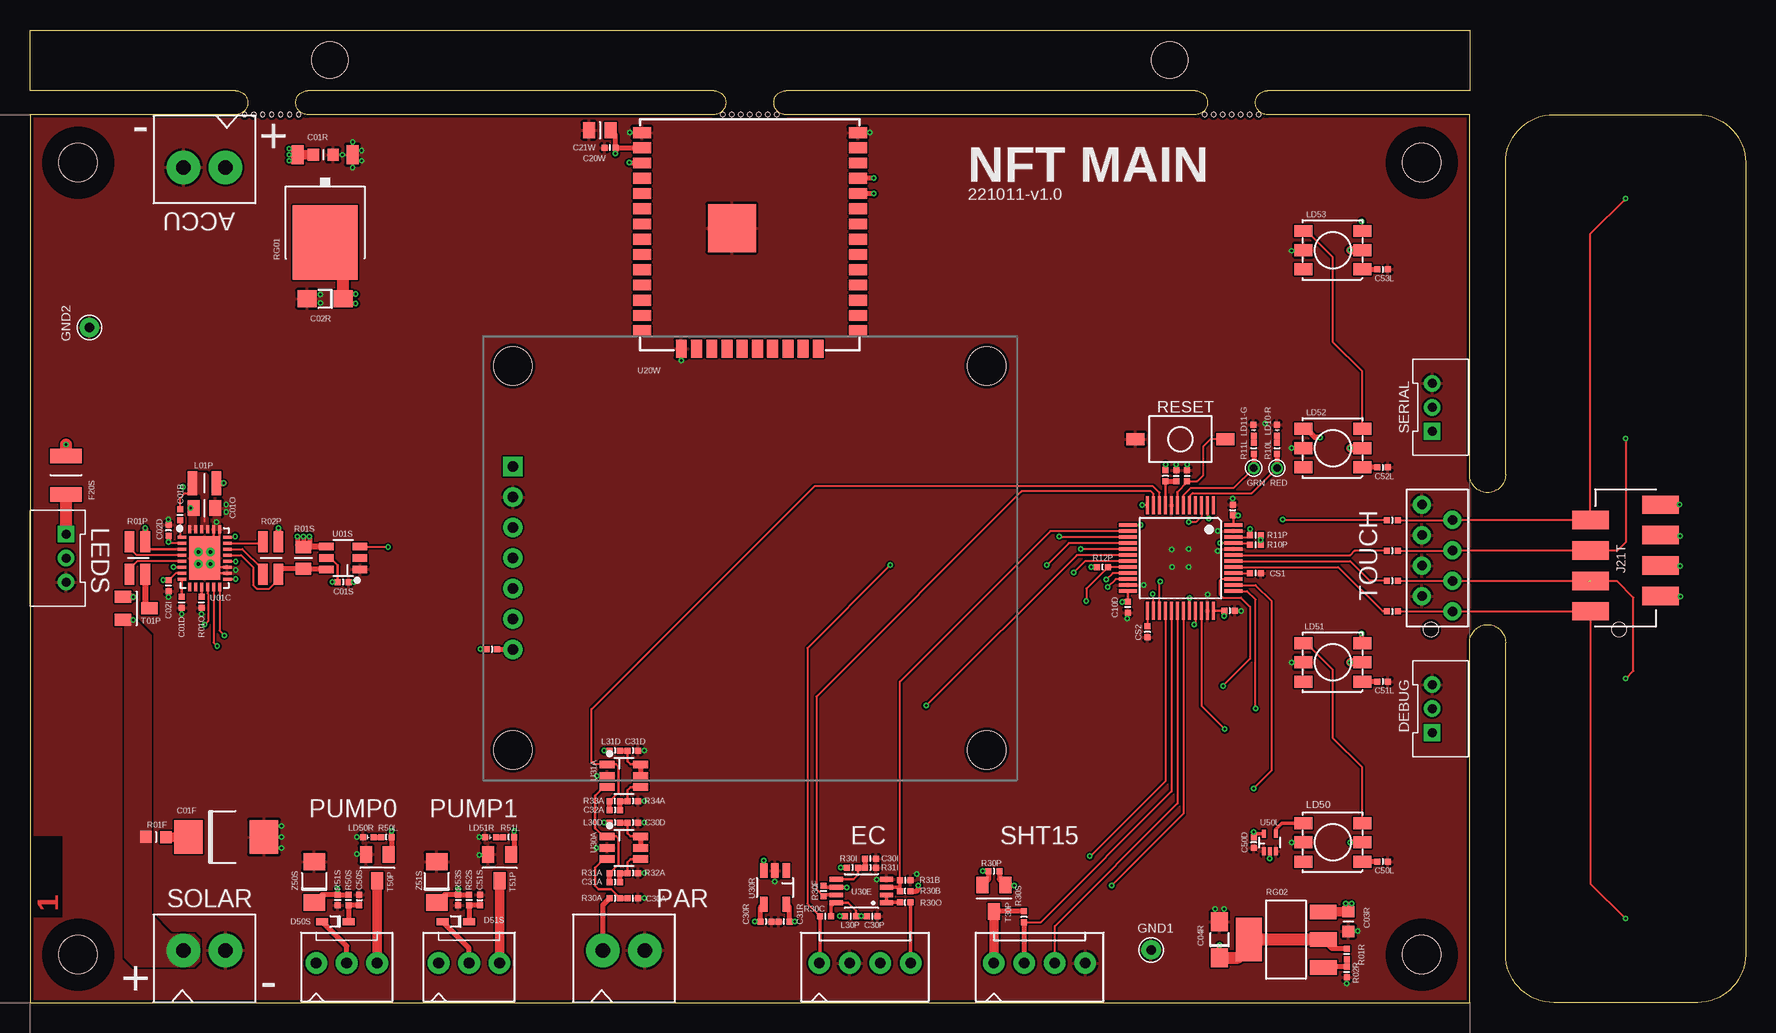
[diagram p5: board, top side]
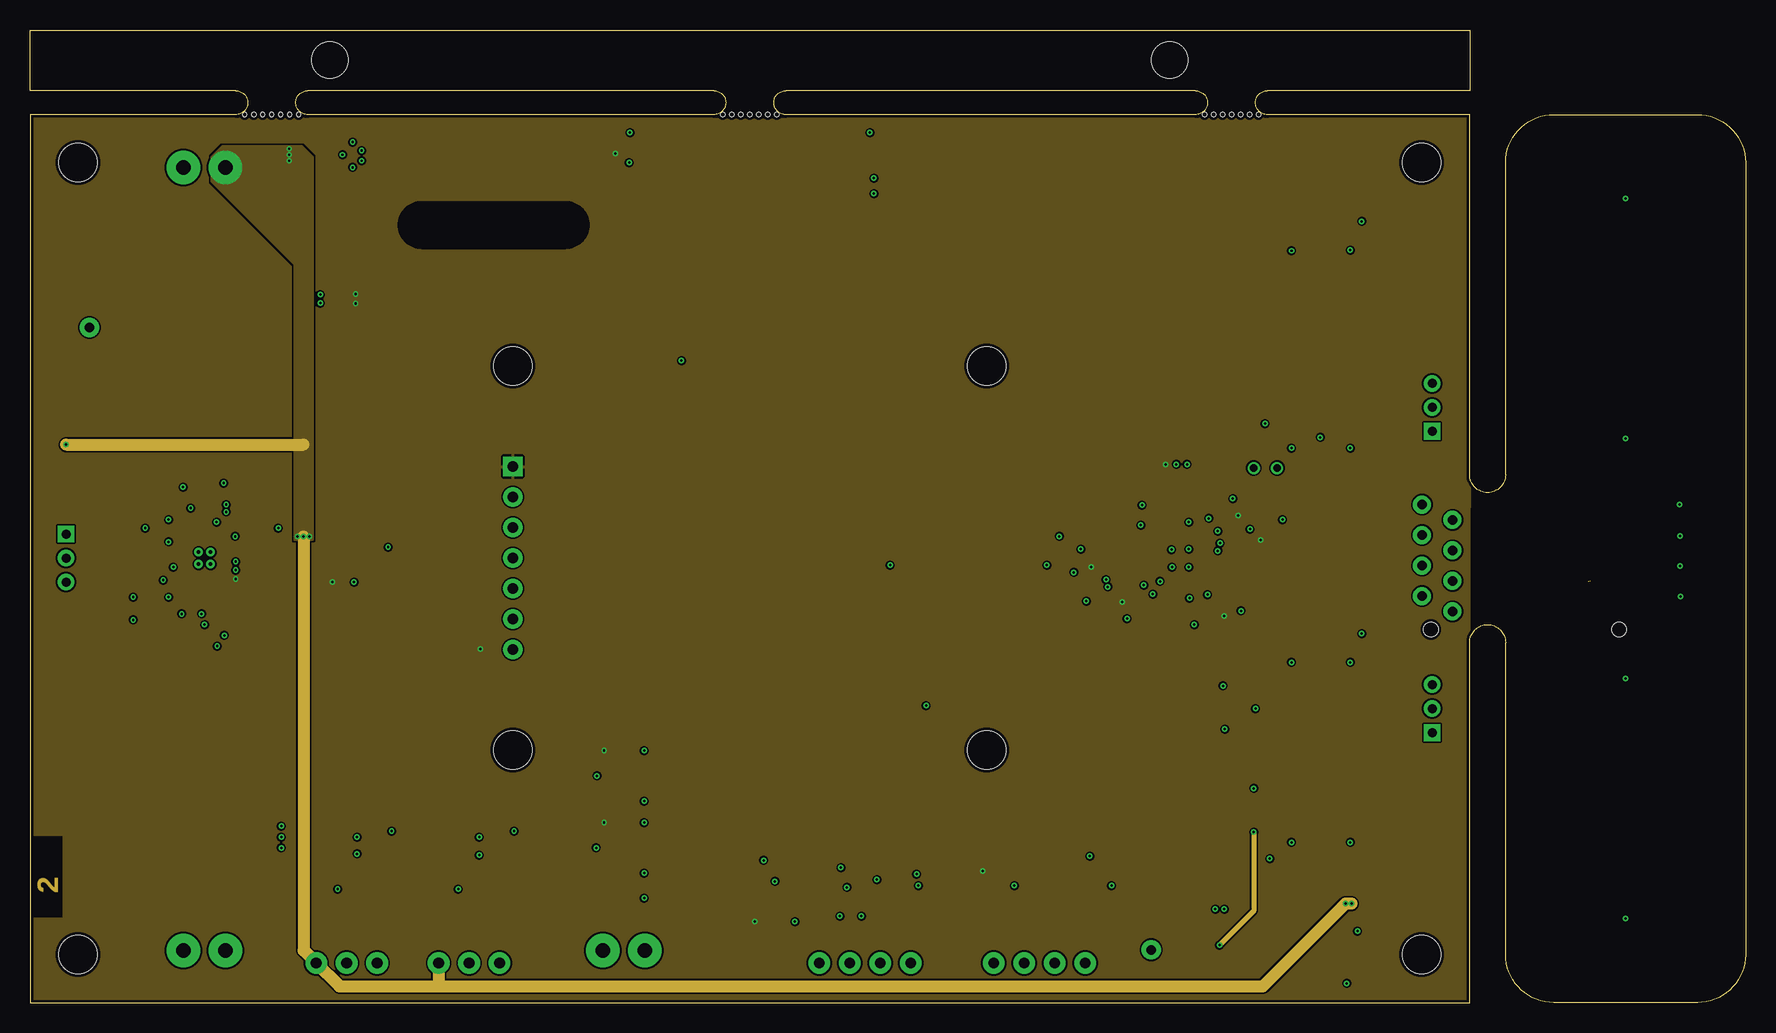
[diagram p6: board, inner layer Route2]
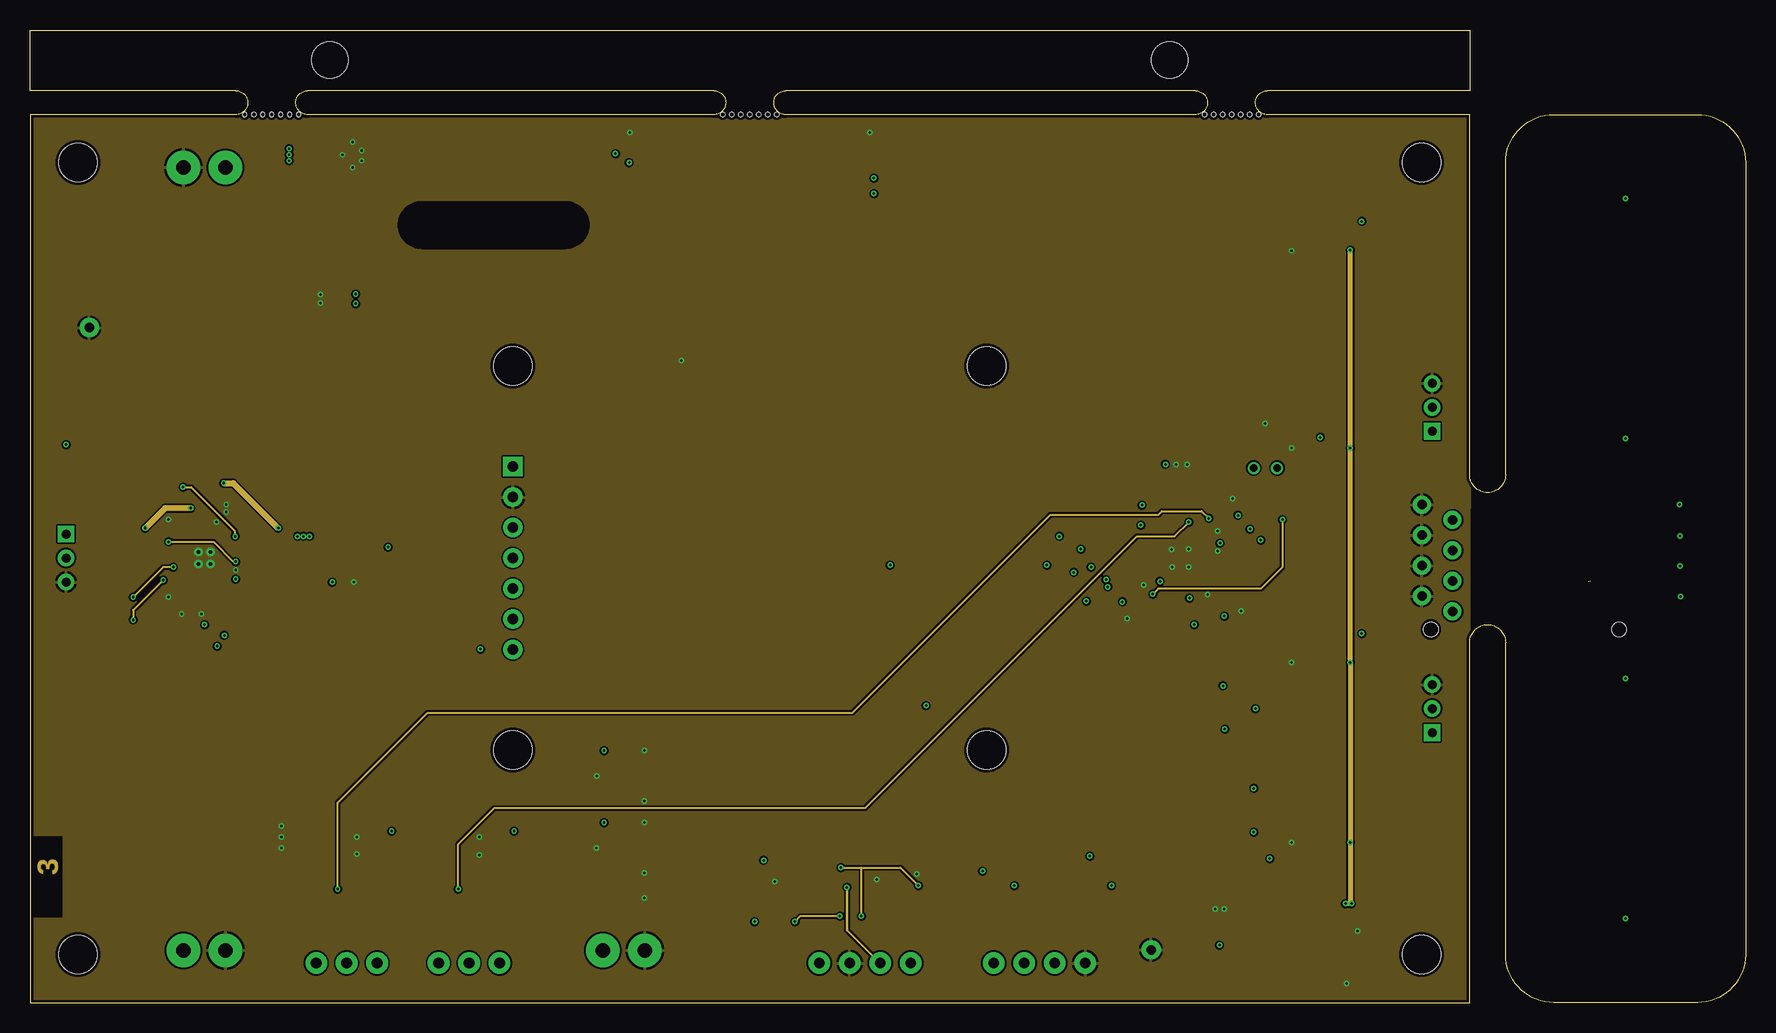
[diagram p7: board, inner layer Route15]
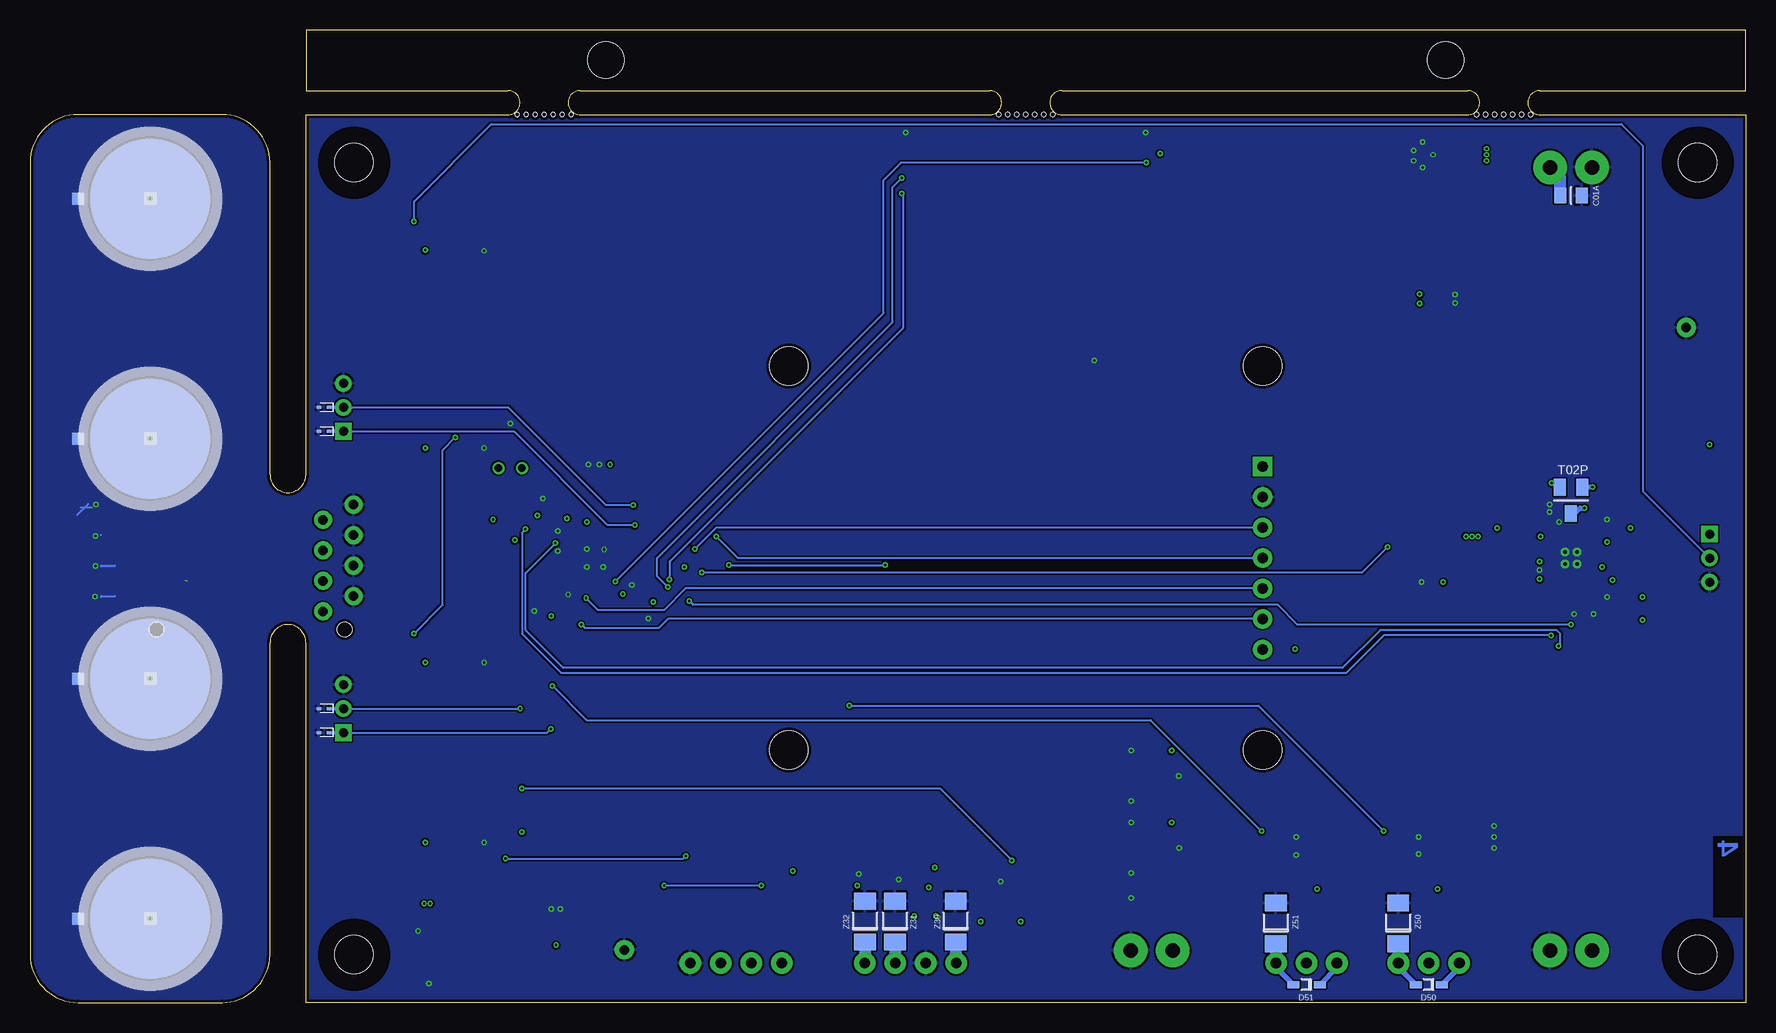
[diagram p8: board, bottom side, seen from below]

Size 143 x 81.05 mm. Coordinates in mm from the lower left corner, seen from the top.
Outline: 103.15,76 120,76 120,81.05 0,81.05 0,76 17.15,76
Outline: 97.15,76 63,76
Outline: 57,76 23.15,76
Outline: 103.15,74 120,74 120,44 arc180 123,44 123,70 arc-90 127,74 139,74 arc-90 143,70 143,4 arc-90 139,0 127,0 arc-90 123,4 123,30 arc180 120,30 120,0 0,0 0,74 17.15,74
Outline: 97.15,74 62.85,74
Outline: 57,74 23.15,74
Copper layers (1*2*15*16): Top 0.018mm / dielectric 0.36mm / Route2 0.035mm / dielectric 0.71mm / Route15 0.035mm / dielectric 0.36mm / Bottom 0.018mm
Design rules "default": minimum track width 0.15mm, minimum drill 0.2mm, track to track 0.15mm, track to pad 0.15mm, pad to pad 0.15mm, via to via 0.15mm, smd to smd 0mil, copper to edge 0.25mm, drill to drill 0.3mm, minimum pad ring 0.2mm, minimum via ring 0.125mm, stop-mask expansion 0.1mm, vias tented up to drill 0.25mm, thermal gap 0.2mm

### Footprints (pad centres in the part's own frame; a part is rotated, then mirrored left to right if it is on the bottom)
CAP0805 = smd 1 x 1.3: 1 -0.9,0; 2 0.9,0
CAP0402 = smd 0.5 x 0.5: 1 -0.45,0; 2 0.45,0
ECAP_SMD = smd 2.4 x 2.8: + -3.15,0; - 3.15,0
CAP0603 = smd 0.95 x 1: 1 -0.821,0.002; 2 0.822,0
ECAP_SMA = smd 1.6 x 1.4: + -1.5,0; - 1.5,0
DIODE_SOD323 = smd 1 x 0.6: 1- -1.1,0; 2 1.1,0
WAVESHARE_1.5"OLED128X128 = drill 0.9 pad 1.6 square: 1 -19.75,7.62 | drill 0.9 pad 1.6: 2 -19.75,5.08; 3 -19.75,2.54; 4 -19.75,0; 5 -19.75,-2.54; 6 -19.75,-5.08; 7 -19.75,-7.62 | hole 3.2: -19.75,-16; -19.75,16; 19.75,16; 19.75,-16
RES1210 = smd 1.2 x 2.6: 1 -1.6,0; 2 1.6,0
HOLE_PTH_0.8MM = drill 0.8 pad 1.6: 1 0,0
HOLE_PTH_0.6MM = drill 0.6 pad 1: 1 0,0
HOLE_NPTH_3.2MM = hole 3.2: 0,0
CON_PHOENIX_COMBICON_MCV_HEADER_P = drill 1.2 pad 2.8: 1 -1.75,0; 2 1.75,0
CON_JST_B3B-PH-K-S = drill 0.75 pad 1.4 square: 1 -2,0 | drill 0.75 pad 1.4: 2 0,0; 3 2,0
CON_MICROMATCH_TOP_8F = drill 0.8 pad 1.5: 1 -4.445,-1.27; 2 -3.175,1.27; 3 -1.905,-1.27; 4 -0.635,1.27; 5 0.635,-1.27; 6 1.905,1.27; 7 3.175,-1.27; 8 4.445,1.27 | hole 1.2: -5.945,0.53
CON_MICROMATCH_TOP_8F_SMD = smd 1.524 x 3.048: 1 -4.445,2.921; 2 -3.175,-2.921; 3 -1.905,2.921; 4 -0.635,-2.921; 5 0.635,2.921; 6 1.905,-2.921; 7 3.175,2.921; 8 4.445,-2.921 | hole 1.2: -5.945,0.53
CON_MOLEX_4V = drill 0.9 pad 1.8: 1 -3.81,0; 2 -1.27,0; 3 1.27,0; 4 3.81,0
CON_MOLEX_3V = drill 0.9 pad 1.8: 1 -2.54,0; 2 0,0; 3 2.54,0
L_1008 = smd 0.8 x 2: 1 -1,0; 2 1,0
L_0402 = smd 0.5 x 0.5: 1 -0.45,0; 2 0.45,0
LED_SMD_0402 = smd 0.5 x 0.5: A -0.45,0; C 0.45,0.001
WS2815 = smd 1.5 x 1: 1 -2.45,1.6; 2 -2.45,0; 3 -2.45,-1.6; 4 2.45,-1.6; 5 2.45,0; 6 2.45,1.6
RES0603 = smd 0.95 x 1: 1 -0.821,0.002; 2 0.822,0
RES0402 = smd 0.5 x 0.5: 1 -0.45,0; 2 0.45,0
RES1206_LVK12R010CER = smd 1.75 x 0.8: 1 -1.372,-0.6; 2 1.372,-0.6; 3 -1.372,0.7; 4 1.372,0.7
RES0805 = smd 1 x 1.3: 1 -0.9,0; 2 0.9,0
SWITCH_SMD_PBUTTON_2P = smd 1.5 x 1: 1 -3.75,0; 2 3.75,0
TO252 = smd 1 x 1.6: 1 -2.28,-4.8; 2 2.28,-4.8 | smd 5.4 x 6.2: 3 0,2.5
SOT223 = smd 1.219 x 2.235: 1 -2.311,-3.1; 2 0,-3.1; 3 2.311,-3.099 | smd 3.607 x 2.184: 4 0,3.099
NFET_SOT23 = smd 1 x 1.4: D 0,1.1; G -0.95,-1.1; S 0.95,-1.1
PFET_SOT23 = smd 1 x 1.4: 1 -0.95,-1.1; 2 0.95,-1.1; 3 0,1.1
CAP_TOUCH_ROUND_10MM_SINGLE = smd 1 x 1: 1 0,0; 2 0,6
QFN28_4X5 = smd 0.7 x 0.25: 1 -1.9,1.75; 2 -1.9,1.25; 3 -1.9,0.75; 4 -1.9,0.25; 5 -1.9,-0.25; 6 -1.9,-0.75; 7 -1.9,-1.25; 8 -1.9,-1.75; 15 1.9,-1.75; 16 1.9,-1.25; 17 1.9,-0.75; 18 1.9,-0.25; 19 1.9,0.25; 20 1.9,0.75; 21 1.9,1.25; 22 1.9,1.75 | smd 0.25 x 0.7: 9 -1.25,-2.4; 10 -0.75,-2.4; 11 -0.25,-2.4; 12 0.25,-2.4; 13 0.75,-2.4; 14 1.25,-2.4; 23 1.25,2.4; 24 0.75,2.4; 25 0.25,2.4; 26 -0.25,2.4; 27 -0.75,2.4; 28 -1.25,2.4 | smd 2.6 x 3.6: 29 0,-0.005 | drill 0.3 pad 0.6: V1 -0.5,0.5; V2 0.5,0.5; V3 -0.5,-0.5; V4 0.5,-0.5
SOT23-6 = smd 0.62 x 1.22: 1 -0.95,-1.4; 2 0,-1.4; 3 0.95,-1.4; 4 0.95,1.4; 5 0,1.4; 6 -0.95,1.4
LQFP48 = smd 0.28 x 1.5: 1 -2.75,-4.4; 2 -2.25,-4.4; 3 -1.75,-4.4; 4 -1.25,-4.4; 5 -0.75,-4.4; 6 -0.25,-4.4; 7 0.25,-4.4; 8 0.75,-4.4; 9 1.25,-4.4; 10 1.75,-4.4; 11 2.25,-4.4; 12 2.75,-4.4; 25 2.75,4.4; 26 2.25,4.4; 27 1.75,4.4; 28 1.25,4.4; 29 0.75,4.4; 30 0.25,4.4; 31 -0.25,4.4; 32 -0.75,4.4; 33 -1.25,4.4; 34 -1.75,4.4; 35 -2.25,4.4; 36 -2.75,4.4 | smd 1.5 x 0.28: 13 4.4,-2.75; 14 4.4,-2.25; 15 4.4,-1.75; 16 4.4,-1.25; 17 4.4,-0.75; 18 4.4,-0.25; 19 4.4,0.25; 20 4.4,0.75; 21 4.4,1.25; 22 4.4,1.75; 23 4.4,2.25; 24 4.4,2.75; 37 -4.4,2.75; 38 -4.4,2.25; 39 -4.4,1.75; 40 -4.4,1.25; 41 -4.4,0.75; 42 -4.4,0.25; 43 -4.4,-0.25; 44 -4.4,-0.75; 45 -4.4,-1.25; 46 -4.4,-1.75; 47 -4.4,-2.25; 48 -4.4,-2.75
ESP32-WROOM-32UE = smd 1.5 x 0.9: 1 -9,7.7; 2 -9,6.43; 3 -9,5.16; 4 -9,3.89; 5 -9,2.62; 6 -9,1.35; 7 -9,0.08; 8 -9,-1.19; 9 -9,-2.46; 10 -9,-3.73; 11 -9,-5; 12 -9,-6.27; 13 -9,-7.54; 14 -9,-8.81; 25 9,-8.81; 26 9,-7.54; 27 9,-6.27; 28 9,-5; 29 9,-3.73; 30 9,-2.46; 31 9,-1.19; 32 9,0.08; 33 9,1.35; 34 9,2.62; 35 9,3.89; 36 9,5.16; 37 9,6.43; 38 9,7.7 | smd 0.9 x 1.5: 15 -5.715,-10.3; 16 -4.445,-10.3; 17 -3.175,-10.3; 18 -1.905,-10.3; 19 -0.635,-10.3; 20 0.635,-10.3; 21 1.905,-10.3; 22 3.175,-10.3; 23 4.445,-10.3; 24 5.715,-10.3 | smd 4 x 4: GND -1.5,-0.25
MSOP8 = smd 0.4 x 1.1: 1 -0.975,-2.1; 2 -0.325,-2.1; 3 0.325,-2.1; 4 0.975,-2.1; 5 0.975,2.1; 6 0.325,2.1; 7 -0.325,2.1; 8 -0.975,2.1
SOT23-5 = smd 0.62 x 1.22: 1 -0.95,-1.4; 2 0,-1.4; 3 0.95,-1.4; 4 0.95,1.4; 5 -0.95,1.4
SOT553-5 = smd 0.3 x 0.67: 1 -0.5,-0.74; 2 0,-0.74; 3 0.5,-0.74; 4 0.5,0.74; 5 -0.5,0.74
EC_MOUSEBITES = hole 0.35: 0,0; 0,-0.75; 0,-1.5; 0,0.75; 0,1.5; 0,2.25; 0,-2.25
EC_TOOL-REGISTRATION = hole 3: 0,0
ZENER_SOD923 = smd 0.36 x 0.25: 1 -0.42,0; 2 0.42,0
ZENER_SOD80 = smd 1.4 x 1.8: 1 -1.7,0; 2 1.7,0

### Placement (x,y rotation side)
C01A  14.55,67.25 0 bottom
C01B  12.5,40.65 90 top
C01D  12.65,33.35 90 top
C01F  16.35,13.8 0 top
C01O  14.55,41.2 0 top
C01R  24.45,70.65 0 top
C01S  26.1,35.05 0 top
C02D  11.55,39.35 270 top
C02I  11.55,34.75 270 top
C02R  24.6,58.65 180 top
C03R  109.9,6.75 270 top
C04R  99.15,5.25 90 top
C10D  91.5,32.95 270 top
C10R  96.45,43.9 90 top
C11D  100,32.66 0 top
C12D  100.25,41.05 90 top
C14A  95.55,43.9 90 top
C20W  48.35,71.25 180 top
C21W  47.5,72.7 180 top
C30A  50.25,8.7 180 top
C30D  50.25,15 0 top
C30I  70.05,12 180 top
C30P  70.2,7.2 0 top
C30R  61.35,6.75 0 top
C31A  48.75,10.05 0 top
C31D  50.25,21 0 top
C31R  62.85,6.75 180 top
C32A  48.75,16.05 0 top
C50D  102,13.35 270 top
C50L  112.75,11.75 0 top
C50S  27.45,8.55 90 top
C51L  112.75,26.75 0 top
C51S  37.5,8.55 90 top
C52L  112.75,44.6 0 top
C53L  112.75,61.1 0 top
CS1  102.15,35.8 0 top
CS2  93.15,30.9 270 top
D50  26.4,1.5 180 bottom
D50S  25.45,6.75 180 top
D51  36.6,1.5 180 bottom
D51S  35.5,6.75 180 top
DIS20  60,37.05 0 top
F20S  3,43.95 90 top
GND1  93.45,4.4 180 top
GND2  4.95,56.25 270 top
GRN  102,44.55 270 top
H1  4,4 0 top
H2  4,70 0 top
H3  116,4 0 top
H4  116,70 0 top
J01I  14.55,4.35 0 top
J01O  14.55,69.6 180 top
J10P  116.88,24.5 90 top
J10U  116.88,49.6 90 top
J20T  117.3,37.05 90 top
J21T  133,37.05 90 top
J30E  69.6,3.3 0 top
J30P  49.5,4.35 0 top
J30S  84.15,3.3 0 top
J50  26.4,3.3 0 top
J50L  3,37.05 270 top
J51  36.6,3.3 0 top
L01P  14.55,43.3 0 top
L10A  94.65,43.9 270 top
L30D  48.75,15 0 top
L30P  68.4,7.2 0 top
L31D  48.75,21 0 top
LD10-R  103.95,47.7 90 top
LD11-G  102,47.7 90 top
LD50  108.6,13.35 180 top
LD50R  28.2,13.8 180 top
LD51  108.6,28.35 180 top
LD51R  38.4,13.8 180 top
LD52  108.6,46.2 180 top
LD53  108.6,62.7 180 top
R01F  10.5,13.8 0 top
R01O  14.3,33.35 90 top
R01P  9,37.05 90 top
R01R  109.75,4.05 270 top
R01S  22.8,37.05 90 top
R02P  20.1,37.05 90 top
R02R  109.75,2.55 270 top
R10L  103.95,46.2 90 top
R10P  102.15,38.15 0 top
R11L  102,46.2 90 top
R11P  102.15,38.95 0 top
R12P  89.4,36.3 180 top
R20R  38.5,29.45 0 top
R20S  113.55,32.6 0 top
R21S  113.55,35.15 0 top
R22S  113.55,37.65 0 top
R23S  113.55,40.2 0 top
R30A  48.75,8.7 0 top
R30B  72.95,9.3 180 top
R30C  66.3,7.2 180 top
R30F  66.15,9.3 270 top
R30I  68.55,11.25 0 top
R30O  72.95,8.35 180 top
R30P  80.35,10.95 0 top
R30S  82.85,7.15 270 top
R31A  48.75,10.8 180 top
R31B  72.95,10.2 0 top
R31I  70.05,11.25 0 top
R32A  50.25,10.8 0 top
R33A  48.75,16.8 180 top
R34A  50.25,16.8 0 top
R50L  29.7,13.8 180 top
R50S  26.55,8.55 270 top
R51L  39.9,13.8 180 top
R51S  25.65,8.55 270 top
R52S  36.6,8.55 270 top
R53S  35.7,8.55 270 top
RED  103.95,44.55 270 top
RESET  95.9,46.95 180 top
RG01  24.6,65.85 180 top
RG02  104.7,5.25 90 top
T01P  8.85,32.85 270 top
T02P  14.55,41.85 180 bottom
T30P  80.35,8.7 180 top
T50P  28.95,11.25 180 top
T51P  39.15,11.25 180 top
TOUCH1  133,7 90 bottom
TOUCH2  133,27 90 bottom
TOUCH3  133,47 90 bottom
TOUCH4  133,67 90 bottom
U01C  14.55,37.05 0 top
U01S  26.1,37.05 90 top
U10  95.9,37.05 180 top
U20W  60,64.8 0 top
U30A  49.5,12.9 270 top
U30E  69.3,9.3 90 top
U30R  62.1,9.6 180 top
U31A  49.5,18.9 270 top
U50L  103.35,13.35 0 top
U$132  [EC_MOUSEBITES]  100.15,74 90 top
U$133  [EC_MOUSEBITES]  60,74 90 top
U$134  [EC_MOUSEBITES]  20.15,74 90 top
U$136  [EC_TOOL-REGISTRATION]  95,78.55 90 top
U$137  [EC_TOOL-REGISTRATION]  25,78.55 90 top
Z10P  118.5,22.5 180 bottom
Z10U  118.5,49.6 180 bottom
Z11P  118.5,24.5 180 bottom
Z11U  118.5,47.6 180 bottom
Z30  65.85,6.75 270 bottom
Z31  70.9,6.75 270 bottom
Z32  73.4,6.75 270 bottom
Z50  28.95,6.6 270 bottom
Z50S  23.7,10.05 270 top
Z51  39.15,6.6 270 bottom
Z51S  33.9,10.05 270 top

### Tracks (layer width: path | path; a pad name or v marks a point on that pad's centre or on a via)
!OLED_RESET
  Top 0.4: R20R.2 40.25,29.45 DIS20.7
!RST
  Top 0.15: C10R.1 97.3,43.45 97.8,43.95 97.8,46.35 98.4,46.95 RESET.1
  Top 0.2: U10.7 95.65,42.55 96.45,43.35 C10R.1
!SHT_PWR  (via drill 0.2 pad 0.4)
  Top 0.15: U10.31 96.15,15.75 v90.15,9.75 | 81.35,9.75 T30P.1
  Top 0.4: R30P.2 80.8,10.3 T30P.1 | v82.05,9.75 81.35,9.75
  Bottom 0.15: v82.05,9.75 v90.15,9.75
!SMBALERT  (via drill 0.2 pad 0.4)
  Top 0.15: U10.20 R12P.1 88.05,34.5 v88.05,33.45 | U01C.12 14.8,34.1 14.85,34.05 14.85,31.8 v14.55,31.5
  Bottom 0.15: v14.55,31.5 37.35,31.5 39,33.15 87.75,33.15 v88.05,33.45
ACCU  (via drill 0.2 pad 0.4)
  Top 0.4: v22.3,38.85 22.3,38.15 22.35,38.1 | v23.3,38.85 23.3,38.05 23.25,38 | v21.6,70.65 RG01.2 | v21.6,71.15 22.3,71.15 22.35,71.1 22.35,70.65 22.35,70.2 22.3,70.15 v21.6,70.15 | v110.15,8.25 110.15,7.7 110.1,7.65 109.98,7.65 C03R.1 | 109.65,7.57 v109.65,8.25 110.1,8.25 110.1,8.2 | v22.8,38.85 R01S.2 | LD50.2 v110.05,13.35
  Top 0.5: U01S.4 23.25,38
  Top 0.7: v110.05,62.7 LD53.2 | LD51.2 v110.05,28.35 | LD52.2 v110.05,46.2
  Top 0.8: RG01.2 22.35,70.65 C01R.1 | RG02.3 109.65,7.57 C03R.1
  Top 1: F20S.2 v3,46.5
  Route2 1: v3,46.5 22.8,46.5 | v22.8,38.85 22.8,4.36 J50.1 25.81,1.35 34.05,1.35 | 34.05,1.35 102.75,1.35 v109.65,8.25 v110.15,8.25 | J51.1 34.06,1.36 34.05,1.35
  Route15 0.4: v109.65,8.25 v110.15,8.25 110.05,8.35 v110.05,13.35 v110.05,28.35 v110.05,46.2 v110.05,62.7
  Bottom 0.4: J51.1 34.06,2.94 D51.1- | 23.86,2.99 23.86,2.94 D50.1-
  Bottom 1: J50.1 23.86,2.99 | C01A.1 15.45,68.75 J01O.1
  pour Route2 (no thermals): 22.05,38.55 22.05,61.5 15.15,68.4 15.15,70.5 16.05,71.4 22.65,71.4 23.55,70.5 23.55,38.55
B0  (via drill 0.2 pad 0.4)
  Top 0.15: TOUCH1.1 130.08,9.92 J21T.1 J20T.1 R20S.2
  other vias: 133,7
B1  (via drill 0.2 pad 0.4)  (1 unrouted)
  Top 0.15: J21T.3 132.25,35.15 133.65,33.75 133.65,27.65 TOUCH2.1 | R21S.2 J20T.3 129.86,35.15 129.9,35.1
  other vias: 133,27
B2  (via drill 0.2 pad 0.4)
  Top 0.15: TOUCH3.1 133.05,46.95 133.05,38.4 132.33,37.69 J21T.5 J20T.5 118.53,37.65 R22S.2
  other vias: 133,47
B3  (via drill 0.2 pad 0.4)
  Top 0.15: TOUCH4.1 130.08,64.08 J21T.7 J20T.7 118.55,40.2 R23S.2
  other vias: 133,67
BATFET  (via drill 0.2 pad 0.4)
  Top 0.15: U01C.22 17.05,38.8 v17.1,38.85
  Route15 0.15: v17.1,38.85 17.1,39.3 13.45,42.95 v12.75,42.95
  Bottom 0.4: v12.75,42.95 T02P.G
BOOST
  Top 0.15: C01B.1 12.5,38.9 12.45,38.85 12.6,38.85 U01C.1
BUTTON0
  Top 0.15: U10.41 109.05,36.3 112.75,32.6 R20S.1
BUTTON1
  Top 0.15: U10.42 110.05,36.8 111.7,35.15 R21S.1
BUTTON2
  Top 0.15: U10.43 110.05,37.3 110.4,37.65 R22S.1
BUTTON3  (via drill 0.2 pad 0.4)
  Top 0.15: 104.38,40.23 v104.4,40.25 104.45,40.2 R23S.1 | U10.26 93.65,34 v93.6,34.05
  Route15 0.15: v93.6,34.05 94.05,34.5 102.6,34.5 104.4,36.3 v104.4,40.25
CHARGER_OUT
  Top 0.15: U01C.19 17.6,37.3 18.6,36.3 18.6,34.8 18.9,34.5 19.95,34.5 20.7,35.25 R02P.1
  Top 0.4: R02P.1 20.7,36.15 R01S.1 22.85,36.1 U01S.6
CLN
  Top 0.15: U01C.4 8.9,37.3 8.3,37.9 R01P.4
CLP
  Top 0.15: U01C.5 8.95,36.8 8.3,36.15 R01P.3
CSAMPLE
  Top 0.15: U10.40 CS1.1
CSAMPLE1
  Top 0.15: U10.25 CS2.1
CSN
  Top 0.15: U01C.20 17.7,37.8 19.35,36.15 19.35,35.73 R02P.3
CSP
  Top 0.15: U01C.21 19.28,38.3 R02P.4
DI
  Top 0.3: LD50.4 104.35,14.95 103.85,14.45 U50L.4
EC
  Top 0.15: U10.11 93.65,42.4 93.45,42.6 82.65,42.6 65.55,25.5 65.55,9.45 R30F.2
  Top 0.3: U30E.7 66.28,8.97 R30F.2
EC30_BUF
  Top 0.3: U30E.2 U30E.1 71.42,8.35 R30O.2
EC_DAC
  Top 0.15: U10.14 85.05,39.3 72.5,26.75 R31B.1
  Top 0.3: R31B.1 72.5,9.6 | 72.5,9.6 R30B.2 | U30E.3 72.47,9.62 72.5,9.6
EC_IN  (via drill 0.2 pad 0.4)
  Top 0.3: R30F.1 66.28,9.62 U30E.6 68.08,9.62 v68.1,9.6
  Route15 0.15: 68.1,6.05 68.12,6.05 J30E.3
  Route15 0.2: v68.1,9.6 68.1,6.05
  Bottom 1: Z31.2 70.9,3.33 J30E.3
EC_NTC  (via drill 0.2 pad 0.4)
  Top 0.15: R30C.2 64.8,8.25 64.8,29.55 v71.7,36.45 | U10.16 86.6,38.3 v84.75,36.45
  Top 0.3: R30C.2 65.85,3.36 J30E.1
  Bottom 0.15: v84.75,36.45 v71.7,36.45
  Bottom 1: Z30.2 65.85,3.36 J30E.1
EC_OUT
  Top 0.3: R30O.1 J30E.4
  Bottom 1: Z32.2 J30E.4
FB1
  Top 0.4: R01R.2 R02R.1 107.86,3 RG02.1
GND  (via drill 0.2 pad 0.4)
  Top 0.15: U01C.29 U01C.V4 | U01C.17 15.45,36.3 15.45,35.8 U01C.16 | U01C.24 15.3,38.55 | 15.3,38.55 15.3,38.25 15.75,38.25 | U01C.23 15.8,39.15 15.75,39.1 15.75,38.55 15.7,38.5 15.35,38.5 15.3,38.55
  Top 0.5: J21T.4 135.94,36.4 v137.55,36.4 | J21T.2 135.95,33.85 v137.6,33.85 | J21T.6 135.98,38.9 v137.55,38.9 | J21T.8 v137.5,41.5
  Bottom 0.15: 137.85,41.25 138.75,41.25 | 137.1,38.95 137.09,38.95 | 137.1,36.35 137.03,36.41 J21T.4 | 137.1,33.8 137.03,33.88 J21T.2 | 138.15,41.55 139.05,40.65
  other vias: 16.35,41.5 17.15,36.05 16.35,40.9 100.95,32.65 100.25,42 96.6,36.3 96.6,37.8 91.45,32 95.2,36.3 95.15,37.75 95.55,44.85 96.45,44.85 12.65,32.4 14.3,32.4 11.55,33.8 11.55,40.25 27,35.05 92.85,34.8 98.15,34 99,39.3 99,37.65 102.95,48.25 105.15,46.2 105.15,28.35 105.15,13.35 110.65,5.95 109.75,1.6 105.15,62.65 70,72.5 50,72.5 54.3,53.5 26.9,71.7 26.9,69.6 27.65,70.15 27.65,71 26.05,70.65 24.2,59 24.2,58.3 15.55,40.05 20.95,14.7 20.95,13.8 20.95,12.9 27.25,12.4 37.45,12.3 27.25,13.8 37.45,13.8 47.2,12.9 47.25,18.9 51.2,21 51.2,16.8 51.2,15 51.2,10.8 51.2,8.7 62.1,10.1 70.6,10.25 73.9,10.7 98.8,7.8 99.55,7.8
  pour Top (rank 6): 120,74.05 120,0.05 0.1,0.05 0.1,74.05
  pour Bottom (rank 6): 120,74.05 120,0.05 0.1,0.05 0.1,74.05
  pour Route15 (rank 3): 119.95,74.05 119.95,58.95 120,54.9 119.95,0.05 0.1,0.2 0.1,74.2
  pour Top (no thermals): 15.3,39.5 15.3,41.3 15.8,41.3 15.8,39.5
  pour Bottom: 120,0 120,74 143,74 143,0
IBAT  (via drill 0.2 pad 0.4)
  Top 0.15: U10.19 87.95,36.8 v87,35.85 | U01S.3 29.8,38 v29.85,37.95
  Bottom 0.15: v87,35.85 31.95,35.85 v29.85,37.95
IMUXF
  Top 0.2: U30A.3 47.8,11.95 47.1,11.25 47.1,9.75 47.4,9.45 48.45,9.45 R30A.2
  Top 0.4: R30A.2 C30A.2
INFET  (via drill 0.2 pad 0.4)
  Top 0.2: U01C.6 v11.95,36.3 | v8.6,33.8 7.95,33.8 7.95,33.75
  Top 0.6: v8.6,33.8 T01P.G
  Route15 0.15: v11.95,36.3 11.1,36.3 v8.6,33.8
INTVCC  (via drill 0.2 pad 0.4)
  Top 0.15: U01C.2 11.65,38.3 v11.55,38.4 | U01C.18 17.1,36.8 v17.15,36.75
  Top 0.4: C02D.2 v11.55,38.4
  Route15 0.15: v17.15,36.75 16.95,36.75 15.3,38.4 v11.55,38.4
LED_DIN  (via drill 0.2 pad 0.4)
  Top 0.15: v88.35,12.2 88.4,12.2 94.65,18.45 U10.28
  Top 0.3: U50L.2 v103.35,12
  Bottom 0.15: v103.35,12 88.55,12 v88.35,12.2
LED_GRN
  Top 0.15: U10.6 96.15,42.3 96.75,42.9 100.35,42.9 GRN.1
  Top 0.4: R11L.1 GRN.1
LED_OUT  (via drill 0.2 pad 0.4)
  Top 0.15: LD53.3 111.05,65.05 v111,65.1
  Bottom 0.15: v111,65.1 111,66.75 104.55,73.2 10.35,73.2 8.55,71.4 8.55,42.6 J50L.2
LED_RED
  Top 0.15: U10.5 96.65,42.2 96.9,42.45 101.85,42.45 RED.1
  Top 0.4: R10L.1 RED.1
N$4
  Top 0.8: R01F.2 C01F.+
N$6
  Top 0.2: C31D.1 49.8,20.1 50.05,19.85 U31A.6
  Top 0.4: L31D.2 C31D.1 | U31A.6 U31A.5
N$7
  Top 0.4: C50L.1 LD50.1
N$8
  Top 0.2: U30E.5 68.62,10.28 69,10.65 R30I.2
  Top 0.4: C30I.2 R31I.1 R30I.2
N$9
  Top 0.4: C51L.1 LD51.1
N$10
  Top 0.5: R01P.1 9.6,33.2 T01P.D
N$11
  Top 0.4: C52L.1 LD52.1
N$12
  Top 0.4: LD53.1 C53L.1
N$13
  Top 0.4: LD51R.A R51L.2
N$14
  Top 0.4: C50S.1 R50S.2 D50S.1-
N$15
  Top 0.2: C30D.1 49.8,14.1 50.05,13.85 U30A.6
  Top 0.4: U30A.6 U30A.5 | L30D.2 C30D.1
N$16  (via drill 0.2 pad 0.4)
  Top 0.5: L01P.2 v16.15,43.3 | v20.7,39.55 R02P.2
  Route15 0.5: v16.15,43.3 16.95,43.3 v20.7,39.55
  Bottom 0.4: 15.5,42.65 T02P.S 15.5,43.3 v16.15,43.3
N$17
  Top 0.4: C51S.1 R52S.2 D51S.1-
N$20
  Top 0.2: R34A.1 49.8,17.7 50.05,17.95 U31A.4
  Top 0.4: R34A.1 R33A.1 C32A.2
N$21
  Top 0.2: R31A.2 49.05,11.55 49.05,13.65 48.85,13.85 U30A.1 47.8,13.85 47.1,14.55 47.1,17.25 47.8,17.95 U31A.3
  Top 0.4: C31A.1 R31A.2
N$22
  Top 0.2: R32A.1 49.8,11.7 50.05,11.95 U30A.4
  Top 0.4: R32A.1 R31A.1 C31A.2
N$23
  Top 0.4: R11L.2 LD11-G.A
N$31
  Top 1: J50L.1 F20S.1
N$39
  Top 0.4: LD10-R.A R10L.2
N$44
  cutout Route15: 46.65,64.8 arc90 44.65,66.8 32.65,66.8 arc90 30.65,64.8 arc90 32.65,62.8 44.65,62.8 arc90
  cutout Route2: 46.65,64.8 arc90 44.65,66.8 32.65,66.8 arc90 30.65,64.8 arc90 32.65,62.8 44.65,62.8 arc90
N$46
  cutout Top: 0.15,7.1 0.15,13.85 2.7,13.85 2.7,7.1
  cutout Bottom: 0.15,7.1 0.15,13.85 2.7,13.85 2.7,7.1
  cutout Route15: 0.15,7.1 0.15,13.85 2.7,13.85 2.7,7.1
  cutout Route2: 0.15,7.1 0.15,13.85 2.7,13.85 2.7,7.1
N$70
  Top 0.4: LD50R.A R50L.2
OLED_CD  (via drill 0.2 pad 0.4)
  Top 0.15: U10.33 97.15,31.6 v97.05,31.5
  Bottom 0.15: v97.05,31.5 96.75,31.2 90.6,31.2 89.83,31.97 DIS20.6
OLED_CS  (via drill 0.2 pad 0.4)
  Top 0.15: U10.32 v96.65,33.7
  Bottom 0.15: DIS20.5 88.34,34.51 90.15,32.7 95.65,32.7 v96.65,33.7
OLED_MOSI  (via drill 0.2 pad 0.4)
  Top 0.15: U10.17 v87.6,37.8
  Bottom 0.15: DIS20.3 85.81,39.59 v87.6,37.8
OLED_SCK  (via drill 0.2 pad 0.4)
  Top 0.15: U10.15 85.85,38.8 v85.8,38.85
  Bottom 0.15: DIS20.4 84,37.05 85.65,38.7 v85.8,38.85
P0
  Top 0.8: T50P.D J50.3
  Bottom 0.4: J50.3 28.94,2.94 D50.2
  Bottom 1: Z50.2 J50.3
P1
  Top 0.8: T51P.D J51.3
  Bottom 0.4: J51.3 39.14,2.94 D51.2
  Bottom 1: Z51.2 J51.3
PAR
  Top 0.15: U10.10 94.15,42.5 93.6,43.05 65.4,43.05 46.8,24.45 46.8,20.1 47.05,19.85 U31A.1
  Top 0.2: R33A.2 49.05,17.55 49.05,19.65 48.85,19.85 U31A.1
  Top 0.4: C32A.1 R33A.2
PAR_IN
  Top 0.4: J30P.1 47.75,8.15 R30A.1
PUMP0  (via drill 0.2 pad 0.4)
  Top 0.15: U10.18 87.25,37.3 v74.7,24.75
  Top 0.4: T50P.G 30.15,12.6 R50L.1 v30.15,14.3
  Bottom 0.15: v74.7,24.75 40.6,24.75 v30.15,14.3
PUMP1  (via drill 0.2 pad 0.4)
  Top 0.15: U10.39 99.35,35.3 99.15,35.1 99.15,34.05 99.45,33.75 100.95,33.75 101.7,33 101.7,28.65 v99.45,26.4
  Top 0.4: T51P.G 40.35,12.6 R51L.1 v40.35,14.3
  Bottom 0.15: v99.45,26.4 96.6,23.55 49.6,23.55 v40.35,14.3
REF_EC  (via drill 0.2 pad 0.4)
  Top 0.15: U10.38 102.15,34.8 103.5,33.45 103.5,19.35 v102,17.85
  Top 0.4: v61.15,11.85 U30R.3
  Bottom 0.15: v102,17.85 67.15,17.85 v61.15,11.85
RT
  Top 0.2: U01C.11 R01O.2
S0
  Top 0.4: J50.2 26.4,4.7 D50S.2
S1
  Top 0.4: J51.2 36.6,4.55 D51S.2
SCL  (via drill 0.2 pad 0.4)
  Top 0.15: U01C.13 15.3,30 v15.6,29.7 | R10P.1 101.55,38.3 U10.45 v99.2,38.3
  Bottom 0.15: v15.6,29.7 15.45,29.85 15.45,30.75 15.75,31.05 30.45,31.05 33.6,27.9 98.55,27.9 101.7,31.05 101.7,35.8 v99.2,38.3
SDA  (via drill 0.2 pad 0.4)
  Top 0.15: U01C.14 15.8,31 v16.2,30.6 | U10.46 101.55,38.8 R11P.1
  Top 0.4: v101.7,39.45 R11P.1
  Bottom 0.15: v16.2,30.6 30.15,30.6 33.3,27.45 98.7,27.45 102,30.75 102,39.15 v101.7,39.45
SER_RXD  (via drill 0.2 pad 0.4)
  Top 0.15: U10.13 v92.6,39.8
  Bottom 0.15: J10U.1 102.65,47.6 94.85,39.8 v92.6,39.8
  Bottom 0.3: Z11U.1 J10U.1
SER_TXD  (via drill 0.2 pad 0.4)
  Top 0.15: U10.12 v92.7,41.45
  Bottom 0.15: J10U.2 103.15,49.6 95,41.45 v92.7,41.45
  Bottom 0.3: Z10U.1 J10U.2
SHT_CLK
  Top 0.15: U10.30 95.65,16.6 85.42,6.37 J30S.3
SHT_DAT
  Top 0.15: U10.29 95.15,17.6 84.25,6.7 R30S.2
  Top 0.4: R30S.2 82.85,3.33 J30S.2
SPEED0  (via drill 0.2 pad 0.4)
  Top 0.15: R51S.1 v25.65,9.45 | U10.2 98.15,40.45 v98.25,40.35
  Top 0.4: R50S.1 R51S.1 24.35,9 Z50S.2
  Route15 0.15: v25.65,9.45 25.65,16.65 33.15,24.15 68.55,24.15 85.05,40.65 94.05,40.65 94.35,40.95 97.65,40.95 v98.25,40.35
SPEED1  (via drill 0.2 pad 0.4)
  Top 0.15: U10.3 97.65,40.5 97.2,40.05 v96.6,40.05
  Top 0.4: R53S.1 R52S.1 | R53S.1 34.55,9 Z51S.2 | R53S.1 v35.7,9.45
  Route15 0.15: v96.6,40.05 95.4,38.85 92.25,38.85 69.6,16.2 38.7,16.2 35.7,13.2 v35.7,9.45
SW
  Top 0.15: 14.55,40.1 14.55,40.5 | C01B.2 12.5,42.05 12.9,42.45 13.65,42.45 13.65,43.2 L01P.1
  pour Top (no thermals): 14.3,39.45 14.3,42.25 14.15,42.4 13.55,42.4 13.45,42.5 13.45,44.05 13.55,44.15 14.65,44.15 14.8,44 14.8,39.45
SWD_CLK  (via drill 0.2 pad 0.4)
  Top 0.15: U10.37 101.45,34.3 102.15,33.6 v102.15,24.5
  Bottom 0.15: J10P.2 v102.15,24.5
  Bottom 0.3: Z11P.1 J10P.2
SWD_IO  (via drill 0.2 pad 0.4)
  Top 0.15: U10.34 97.65,24.75 v99.6,22.8
  Bottom 0.15: J10P.1 99.9,22.5 v99.6,22.8 99.53,22.88
  Bottom 0.3: Z10P.1 J10P.1
V0  (via drill 0.2 pad 0.4)
  Top 0.2: U30E.8 68.17,8.32 68.85,7.65 68.85,7.35 69,7.2
  Top 0.3: R30C.1 66.75,8.05 67,8.3 67.17,8.3 U30E.8
  Top 0.4: L30P.2 69,7.2 v69.3,7.2 C30P.1 | R30I.1 v67.6,11.25 | R30B.1 73.9,9.3 74.05,9.45 v74.05,9.75
  Route15 0.15: v67.6,11.25 69.3,11.25 | 69.3,11.25 72.55,11.25 v74.05,9.75 | v69.3,7.2 69.3,11.25
VCC  (via drill 0.2 pad 0.4)
  Top 0.3: U50L.5 102.29,14.09 C50D.1
  Top 0.4: R01R.1 108.55,4.5 RG02.2 | C04R.+ v99.15,4.8 | v102,14.2 C50D.1
  Top 1: RG02.2 RG02.4 101.6,4.65 100.7,3.75 C04R.+
  Route2 0.4: v102,14.2 102,7.65 v99.15,4.8
VCC2P5
  Top 0.2: U01C.8 C01D.2
VCCA  (via drill 0.2 pad 0.4)
  Top 0.3: C31R.1 v63.75,6.75 | v67.5,7.2 L30P.1
  Top 0.4: C31R.1 63.3,7.95 U30R.5
  Route15 0.15: v67.5,7.2 64.2,7.2 v63.75,6.75
VDD_3V3  (via drill 0.2 pad 0.4)
  Top 0.15: 100.3,40.55 C12D.1
  Top 0.2: C11D.1 U10.36 | C10D.1 U10.24 | U10.48 100.3,40.55 | U01C.15 v17.15,35.3 | C01S.1 25.65,36.45 25.05,37.05 U01S.5
  Top 0.4: C11D.1 v99.55,32.2 | L10A.1 v94.65,44.85 | v100.7,40.6 C12D.1 | L31D.1 v47.85,21 | L30D.1 v47.85,15 | T30P.2 79.9,10.3 R30P.1 v79.4,10.95 | U30R.4 60.9,7.95 C30R.1 v60.4,6.75 | C01S.1 v25.2,35.05 | v27.15,58.25 26.2,58.25 26.1,58.35 C02R.+ | v27.15,59.05 26.2,59.05 26.1,58.95 | C20W.1 v48.8,70.75 | C20W.1 50.98,71.25 U20W.2 | R10P.2 v102.6,38.55 R11P.2 | C10D.1 v91.06,33.41 v91.05,33.4 | C20W.1 48.8,72.3 C21W.1 | R12P.2 v88.45,36.3
  Top 0.5: R20R.1 v37.55,29.45
  Top 1: C02R.+ 26.1,58.95 26.1,61.85 RG01.3
  pour Route2 (rank 2): 119.95,0.1 0.1,0.05 0.1,74.05 120,74.05 120,54.9
VDDA
  Top 0.2: U10.9 L10A.2
  Top 0.4: L10A.2 C14A.1
VOUT  (via drill 0.2 pad 0.4)
  Top 0.2: U01C.3 9.75,37.8 9.6,37.95 R01P.2
  Top 0.5: v13.4,41.2 C01O.1 | v9.6,39.55 R01P.2
  Route15 0.5: v13.4,41.2 11.25,41.2 v9.6,39.55
  Bottom 0.4: T02P.D 14.55,40.45 13.8,41.2 v13.4,41.2
  pour Top (no thermals): 13.3,39.45 13.3,41.2 13.8,41.2 13.8,39.45
VSUN  (via drill 0.2 pad 0.4)
  Top 0.15: U01C.7 12.15,35.8 C02I.1 | v8.6,31.9 T01P.S
  Top 0.4: C02I.1 v11.1,35.2
  Route15 0.15: v11.1,35.2 8.6,32.7 v8.6,31.9
  pour Top (no thermals): 13.65,3 8.7,3 7.95,3.75 7.95,32.1 8.55,32.1 10.05,30.6 10.05,7.35 11.7,5.7 13.65,5.7 14.1,5.25 14.1,3.45
VY
  Top 0.4: R30S.1 T30P.3
  Top 0.8: T30P.3 J30S.1
WIFI_EN  (via drill 0.2 pad 0.4)
  Top 0.15: U10.27 94.15,35.05 v94.2,35.1
  Top 0.4: v49.95,70 50.96,70 U20W.3
  Bottom 0.15: v94.2,35.1 71.85,57.45 71.85,68.55 70.4,70 v49.95,70
WIFI_RXD  (via drill 0.2 pad 0.4)
  Top 0.15: U20W.35 | U10.22 90.5,35.3 v89.85,34.65
  Top 0.4: v70.35,68.7 U20W.35
  Bottom 0.15: v89.85,34.65 90.75,35.55 90.75,37.05 71.1,56.7 71.1,67.95 v70.35,68.7
WIFI_TXD  (via drill 0.2 pad 0.4)
  Top 0.15: U10.21 90.25,35.8 v89.7,35.25
  Top 0.4: v70.35,67.42 U20W.34
  Bottom 0.15: v70.35,67.42 70.2,67.27 70.2,56.25 89.7,36.75 v89.7,35.25
X0
  Top 0.15: LD50.3 111.05,19.6 108.6,22.05 108.6,27.75 106.35,30 106.2,30 LD51.4
X1  (via drill 0.2 pad 0.4)
  Top 0.15: LD51.3 111,30 | 106.5,47.7 106.25,47.7 LD52.4
  Top 0.4: 111,30 v111,30.75 | v107.55,47.1 107.1,47.1 106.5,47.7
  Bottom 0.15: v111,30.75 108.6,33.15 108.6,46.05 v107.55,47.1
X2
  Top 0.15: LD52.3 111.05,52.6 108.6,55.05 108.6,62.1 106.35,64.35 106.2,64.35 LD53.4

### Text on the board
Top: 1
Route2: 2
Route15: 3
Bottom: 4
tPlace: - | + | NFT MAIN | 221011-v1.0 | ACCU | SERIAL | LEDS | TOUCH | DEBUG | PUMP0 | PUMP1 | EC | SHT15 | SOLAR | PAR | + | -
tRestrict: CADWEASEL
bRestrict: CADWEASEL